# EasyEDA Pro project 多组分NO.2.eprj, schematic 多组分

## Sheets
1 主板: Board Name: Board1; Create Date: 2025-03-08; Page Name: 主板; Project Name: 多组分NO.2; Schematic Name: 多组分; Update Date: 2025-04-07; Company: 嘉立创EDA; Page Size: A4; Version: V1.0
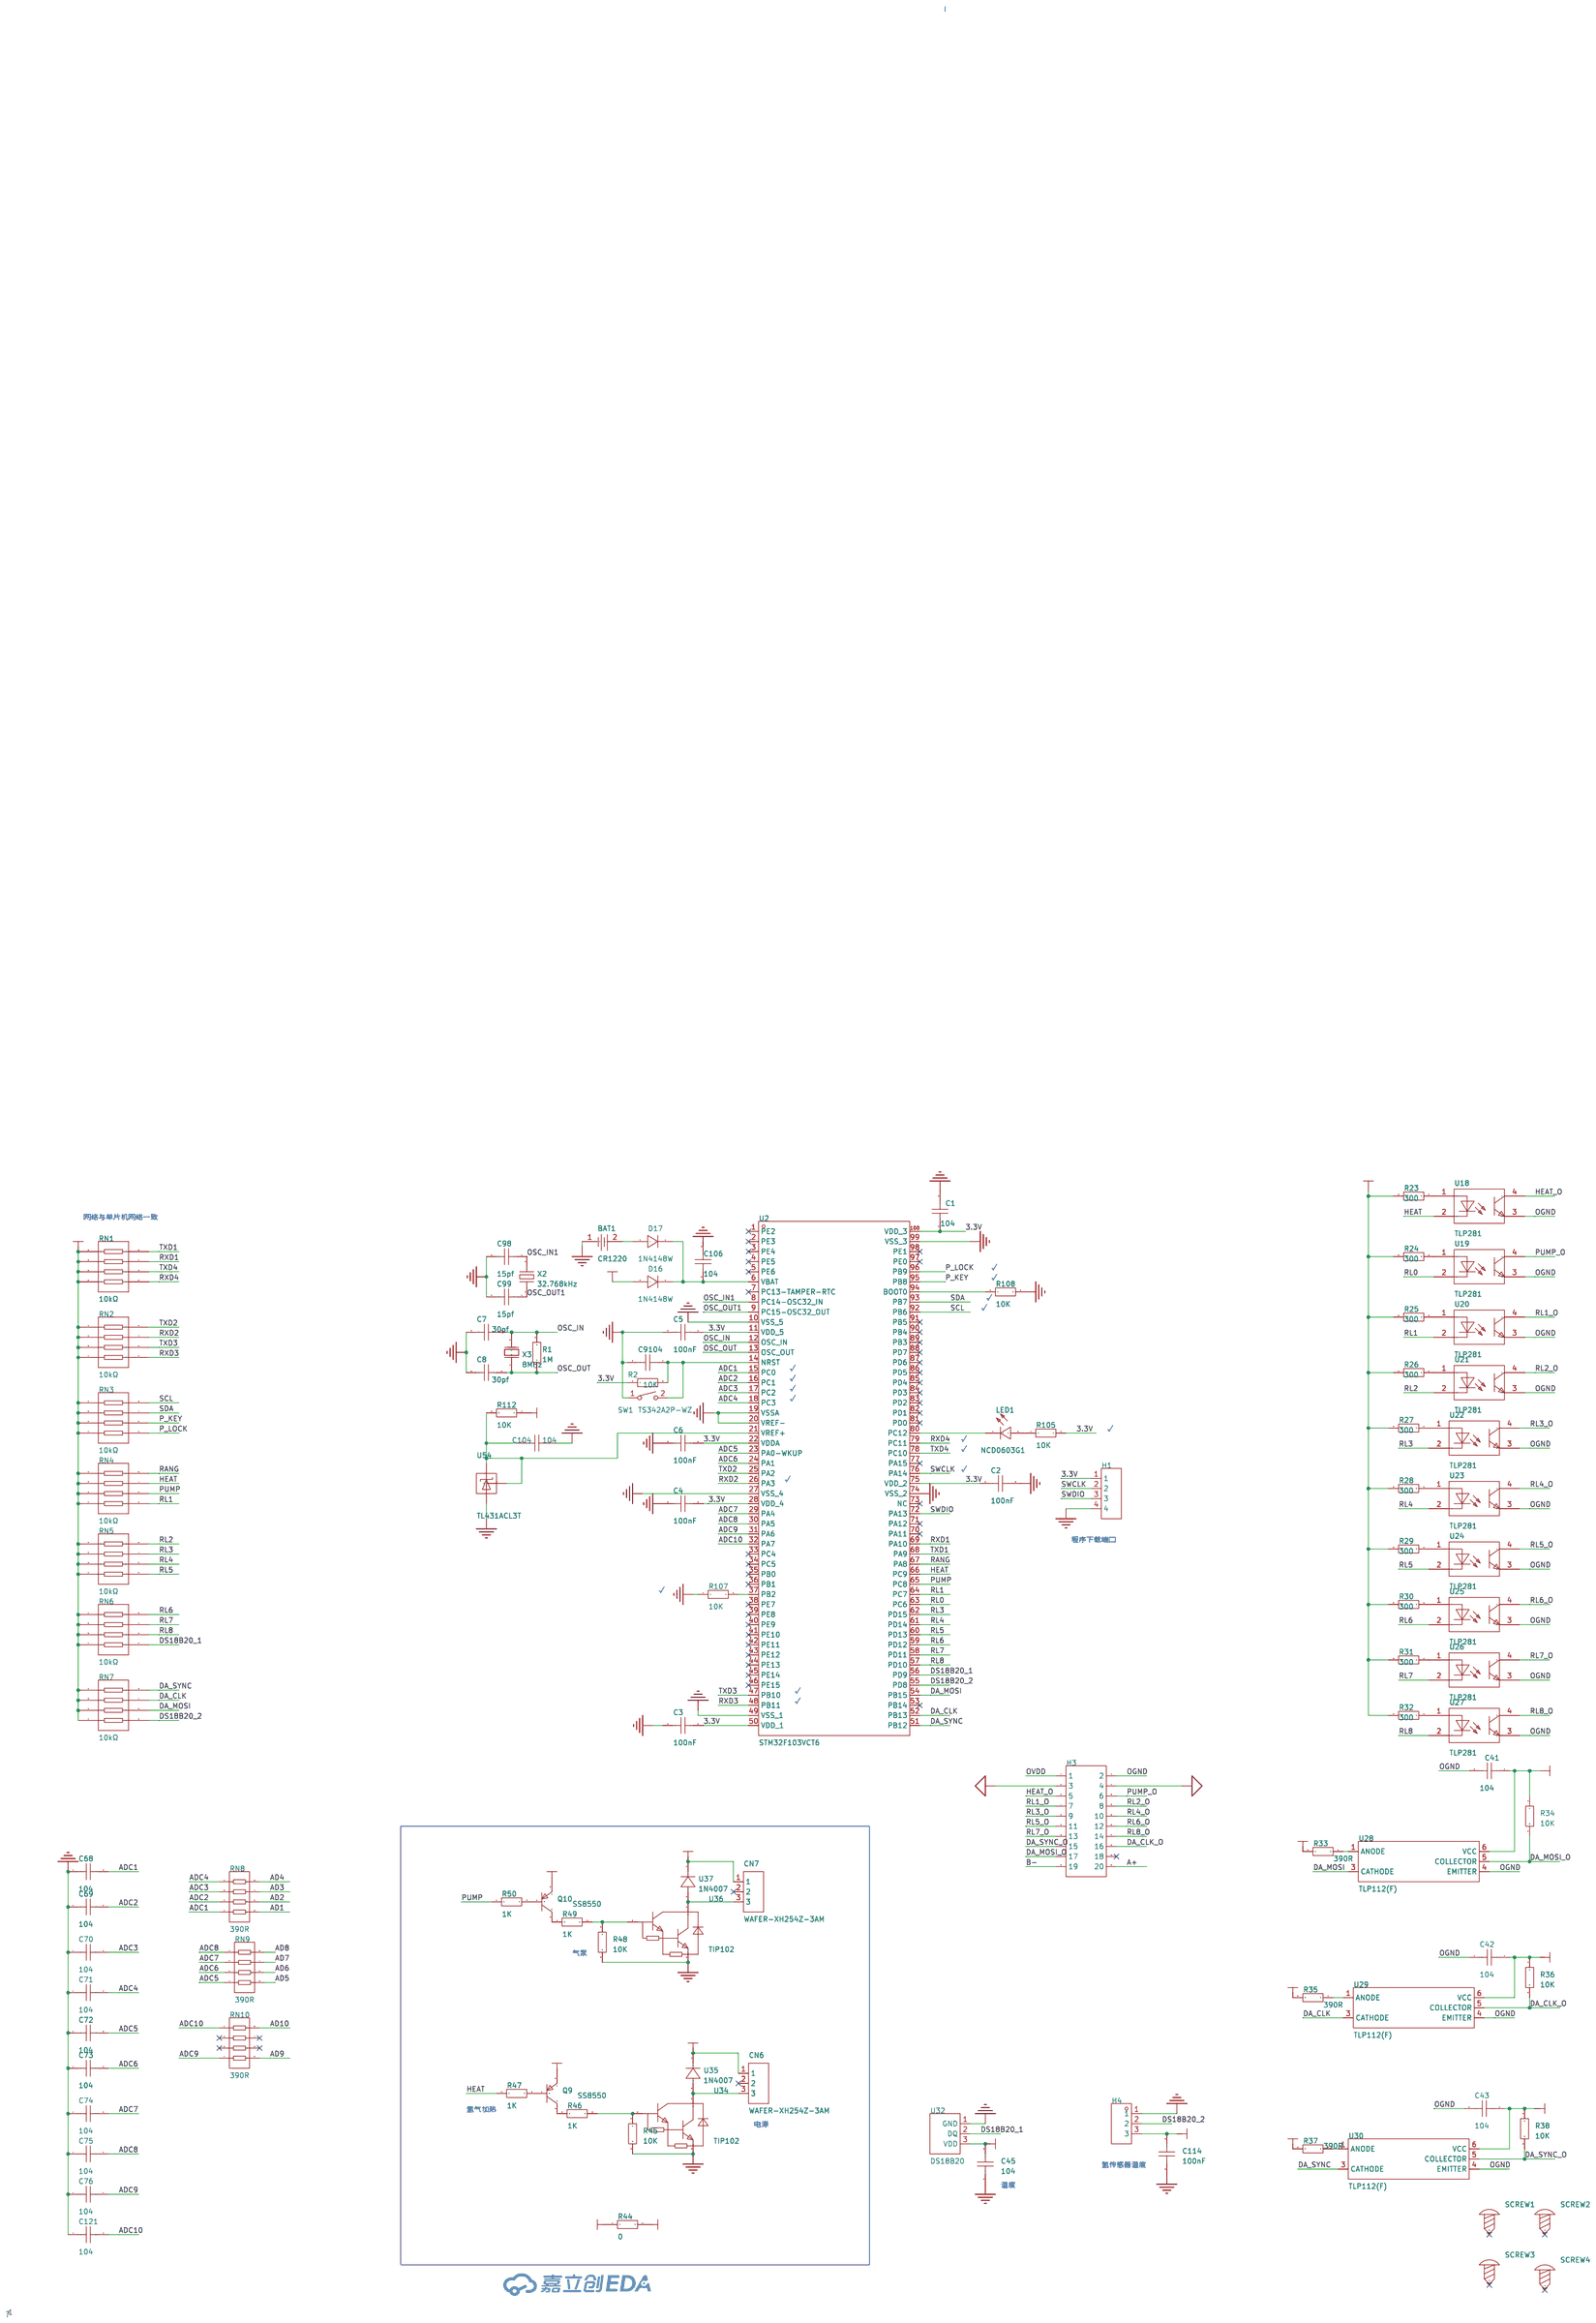
[diagram p0: 主板]
2 电源: Create Date: 2025-03-31; Page Name: 电源
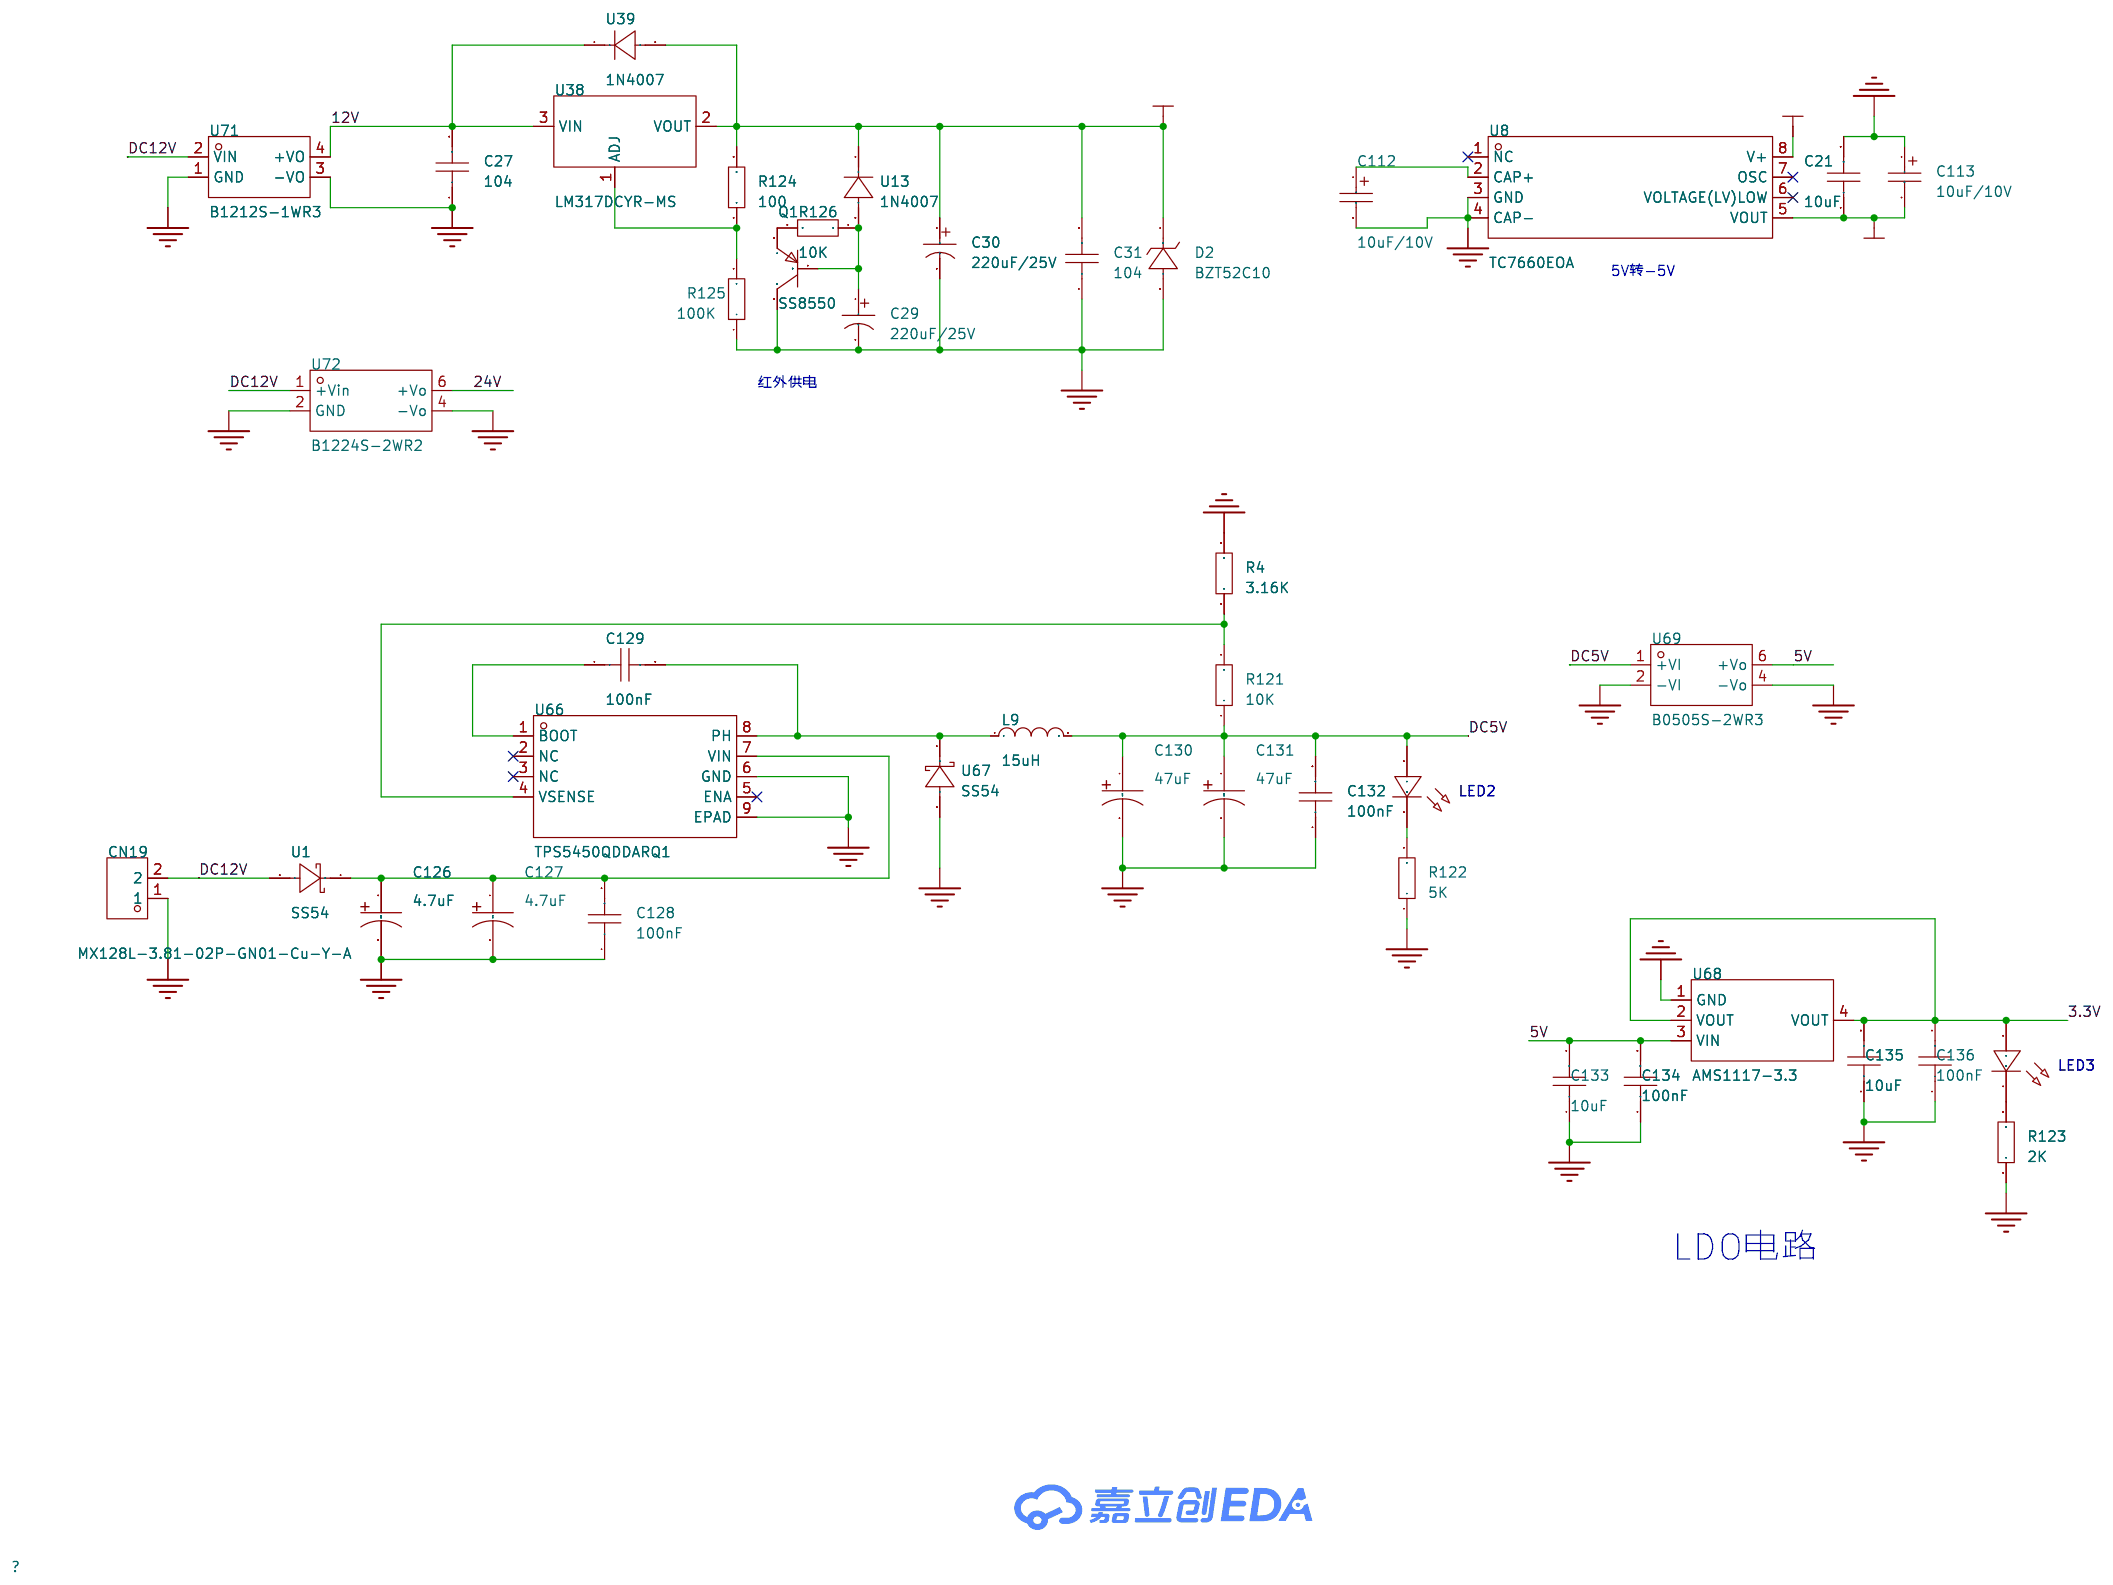
[diagram p1: 电源]
3 通讯: Create Date: 2025-03-31; Page Name: 通讯
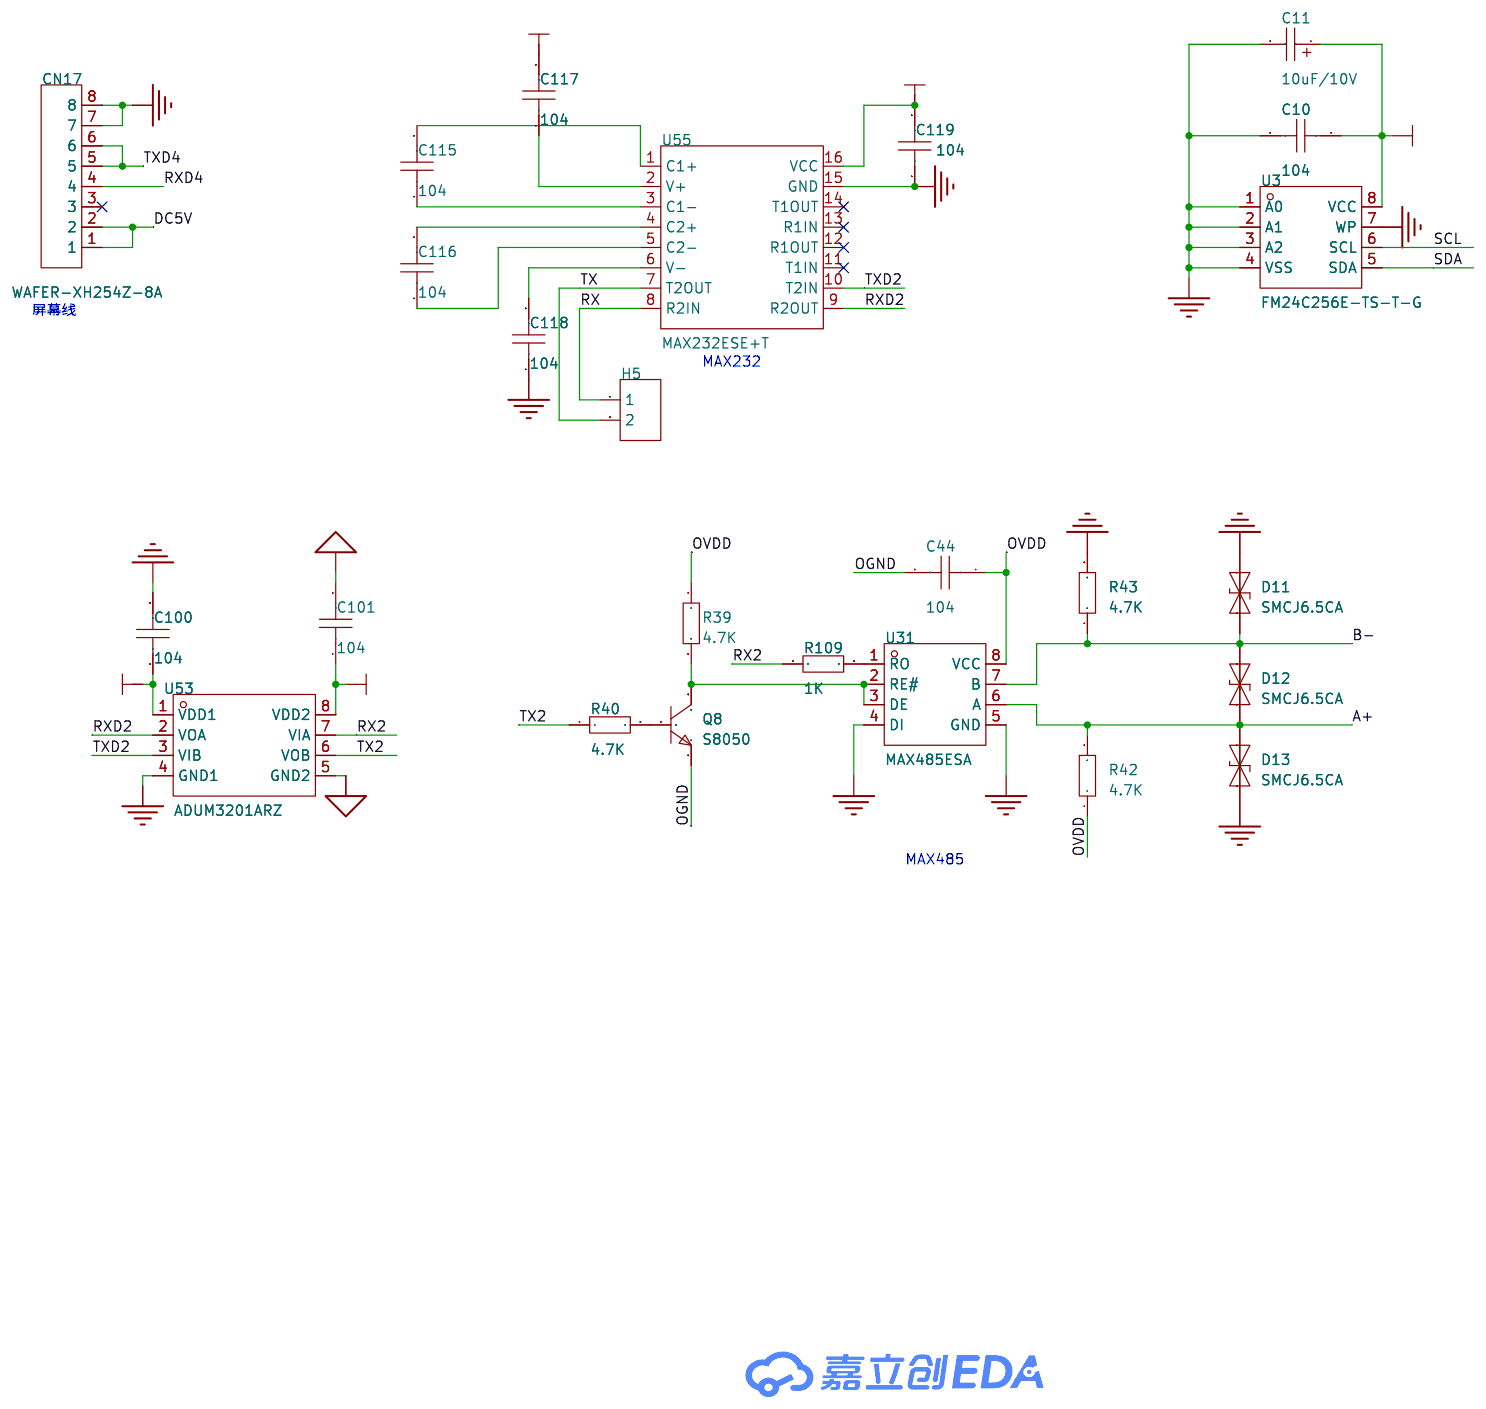
[diagram p2: 通讯]
4 采集: Create Date: 2025-04-03; Page Name: 采集
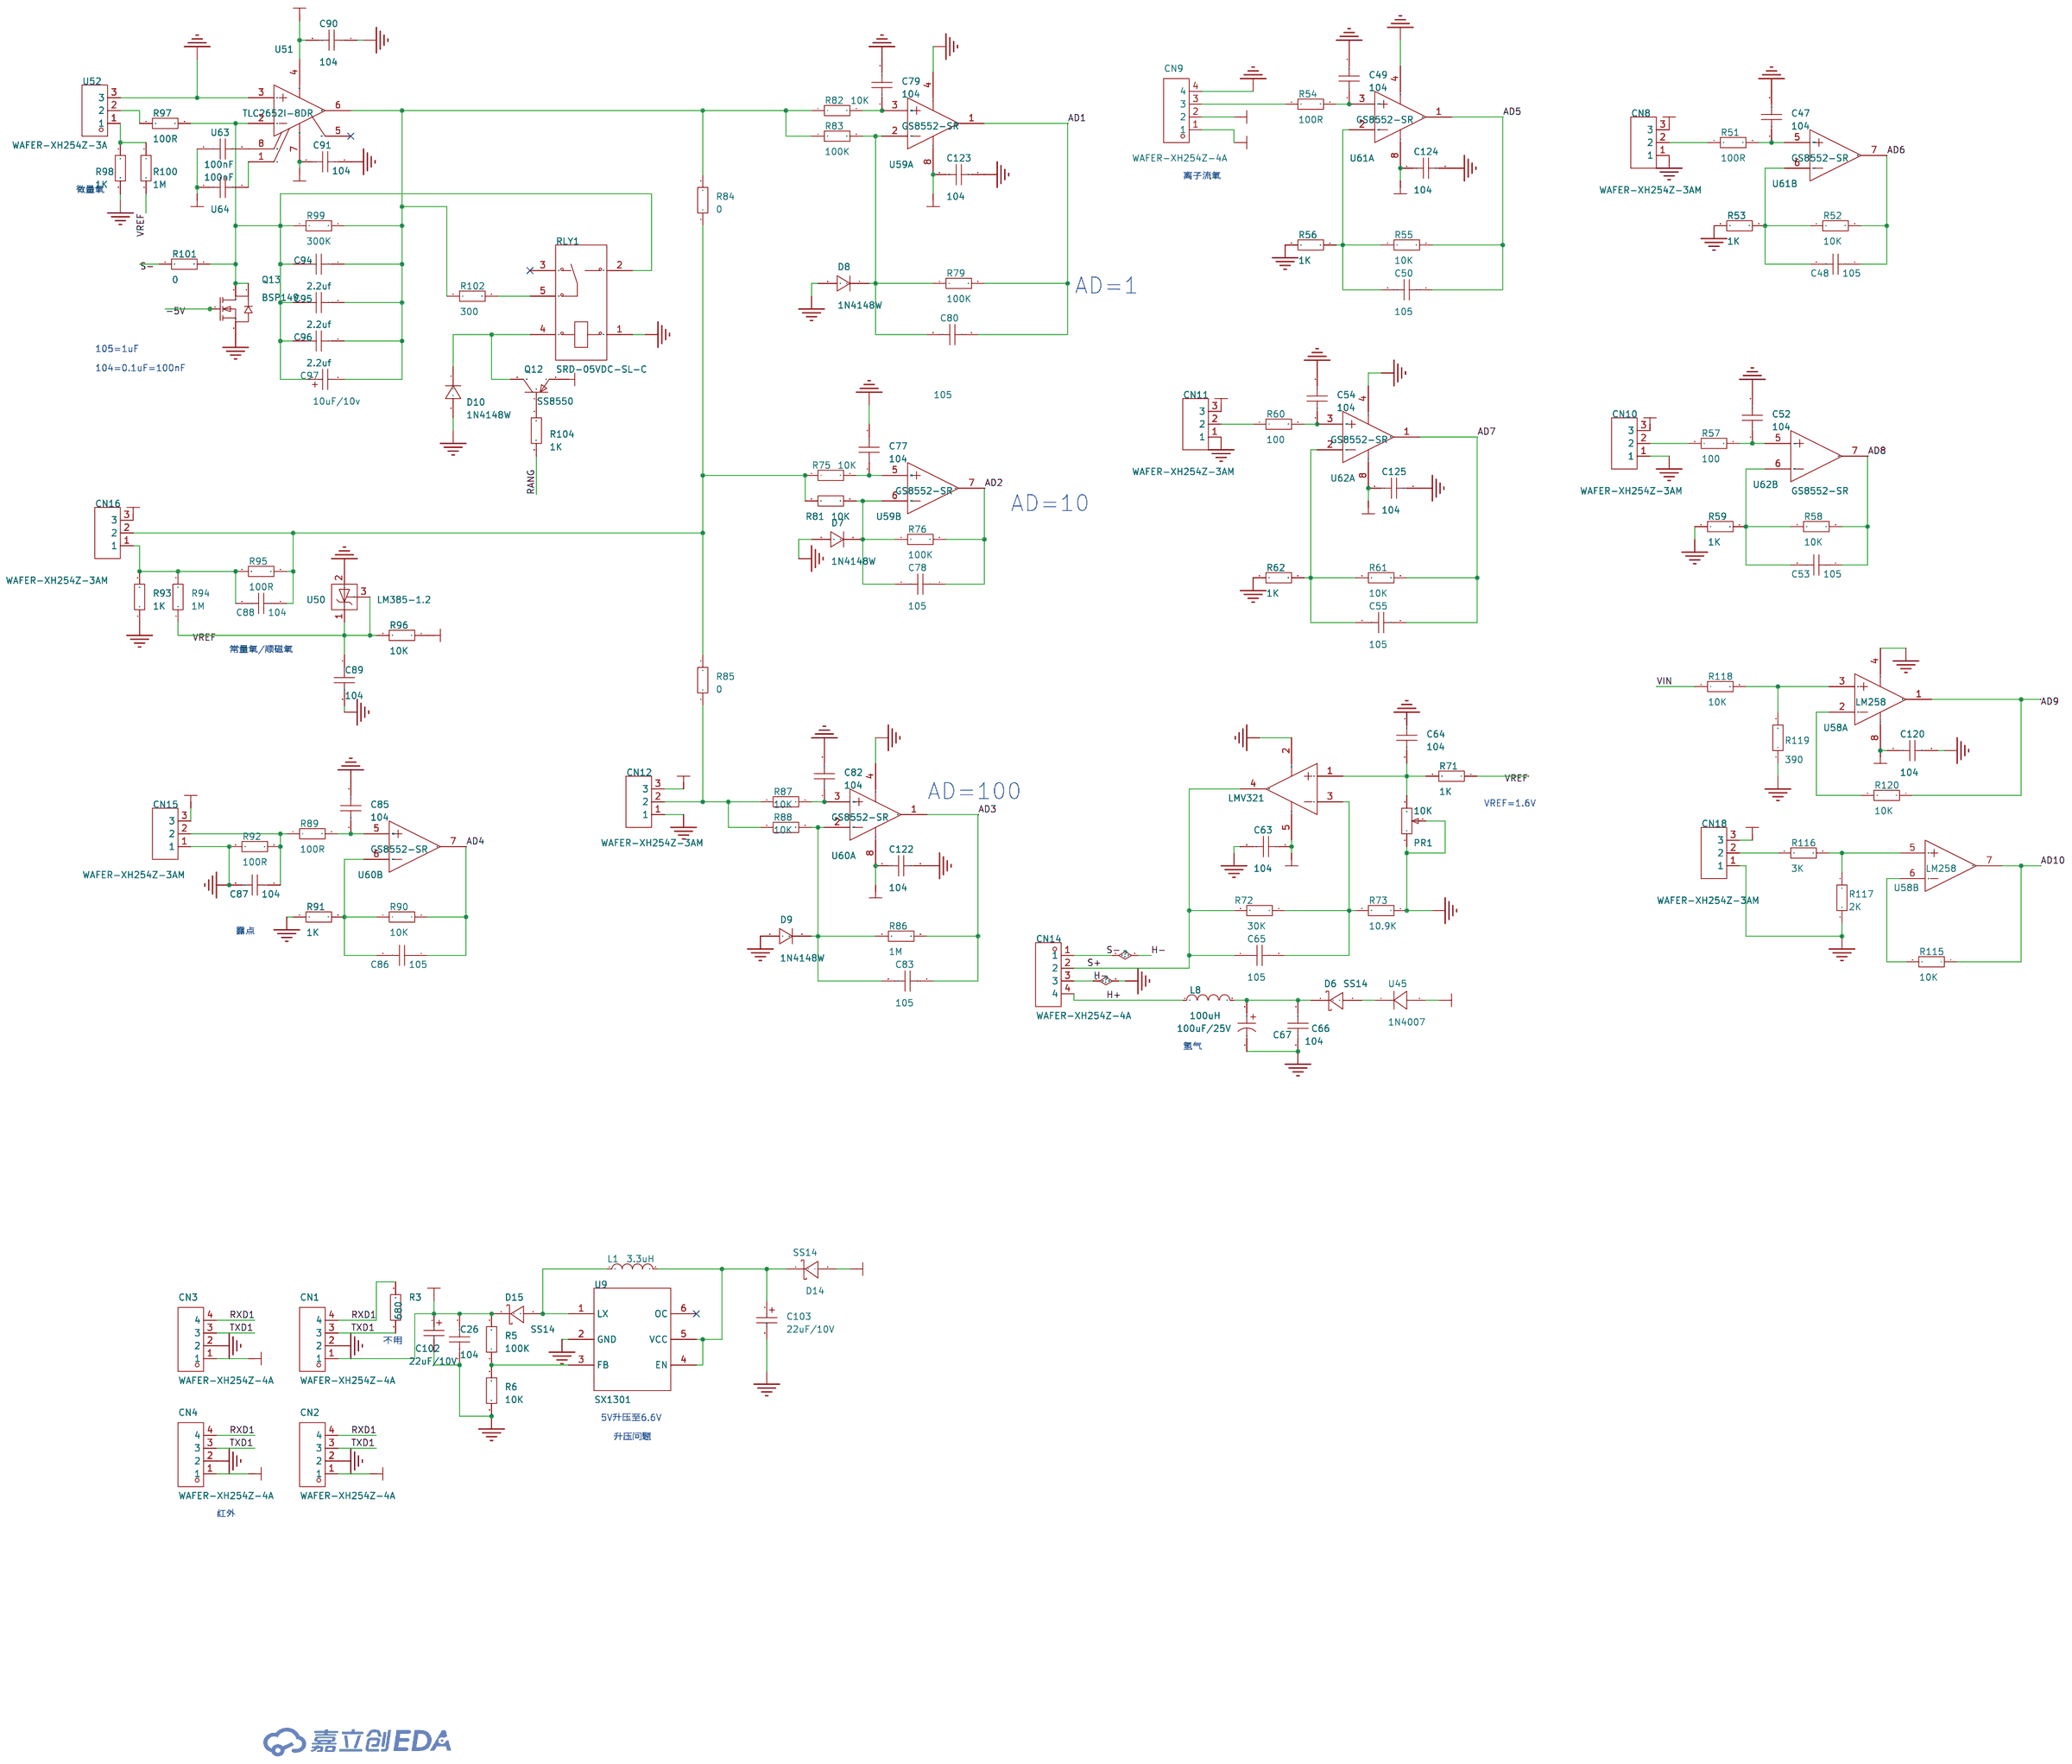
[diagram p3: 采集]

## Parts
sheet 主板
BAT1  CR1220  [TH_BD12.5-P12.0-RD-CR1220]
C1  104  [C0603]
C2  100nF  [C0603]
C3  100nF  [C0603]
C4  100nF  [C0603]
C5  100nF  [C0603]
C6  100nF  [C0603]
C7  30pf  [C0603]
C8  30pf  [C0603]
C9  104  [C0603]
C41  104  [C0603]
C42  104  [C0603]
C43  104  [C0603]
C45  104  [C0603]
C68  104  [C0603]
C69  104  [C0603]
C70  104  [C0603]
C71  104  [C0603]
C72  104  [C0603]
C73  104  [C0603]
C74  104  [C0603]
C75  104  [C0603]
C76  104  [C0603]
C98  15pf  [C0603]
C99  15pf  [C0603]
C104  104  [C0603]
C106  104  [C0603]
C114  100nF  [C0603]
C121  104  [C0603]
CN6  WAFER-XH254Z-3AM  [CONN-TH_3P-P2.50_JS25T-S03XHW-00]
CN7  WAFER-XH254Z-3AM  [CONN-TH_3P-P2.50_JS25T-S03XHW-00]
D16  1N4148W  [SOD-123F_L2.7-W1.6-LS3.8-RD]
D17  1N4148W  [SOD-123F_L2.7-W1.6-LS3.8-RD]
H1  -  [HDR-TH_4P-P2.54-V-M]
H3  -  [HDR-TH_20P-P2.54-V-R2-C10-S2.54]
H4  -  [HDR-TH_3P-P2.54-V-F]
LED1  NCD0603G1  [LED0603-RD_1]
Q9  SS8550  [SOT-23-3_L2.9-W1.3-P1.90-LS2.4-BR]
Q10  SS8550  [SOT-23-3_L2.9-W1.3-P1.90-LS2.4-BR]
R1  1M  [R0603]
R2  10K  [R0603]
R23  300  [R0603]
R24  300  [R0603]
R25  300  [R0603]
R26  300  [R0603]
R27  300  [R0603]
R28  300  [R0603]
R29  300  [R0603]
R30  300  [R0603]
R31  300  [R0603]
R32  300  [R0603]
R33  390R  [R0603]
R34  10K  [R0603]
R35  390R  [R0603]
R36  10K  [R0603]
R37  390R  [R0603]
R38  10K  [R0603]
R44  0  [R0603]
R45  10K  [R0603]
R46  1K  [R0603]
R47  1K  [R0603]
R48  10K  [R0603]
R49  1K  [R0603]
R50  1K  [R0603]
R105  10K  [R0603]
R107  10K  [R0603]
R108  10K  [R0603]
R112  10K  [R0603]
RN1  10kΩ  [RES-ARRAY-SMD_0603-8P-L3.2-W1.6-BL]
RN2  10kΩ  [RES-ARRAY-SMD_0603-8P-L3.2-W1.6-BL]
RN3  10kΩ  [RES-ARRAY-SMD_0603-8P-L3.2-W1.6-BL]
RN4  10kΩ  [RES-ARRAY-SMD_0603-8P-L3.2-W1.6-BL]
RN5  10kΩ  [RES-ARRAY-SMD_0603-8P-L3.2-W1.6-BL]
RN6  10kΩ  [RES-ARRAY-SMD_0603-8P-L3.2-W1.6-BL]
RN7  10kΩ  [RES-ARRAY-SMD_0603-8P-L3.2-W1.6-BL]
RN8  390R  [RES-ARRAY-SMD_0603-8P-L3.2-W1.6-BL]
RN9  390R  [RES-ARRAY-SMD_0603-8P-L3.2-W1.6-BL]
RN10  390R  [RES-ARRAY-SMD_0603-8P-L3.2-W1.6-BL]
SCREW1  -  [M3螺丝]
SCREW2  -  [M3螺丝]
SCREW3  -  [M3螺丝]
SCREW4  -  [M3螺丝]
SW1  TS342A2P-WZ  [SW-SMD_L4.0-W2.9-LS5.0]
U2  STM32F103VCT6  [LQFP-100_L14.0-W14.0-P0.50-LS16.0-BL]
U18  TLP281  [SOP-4_L4.4-W2.6-P1.27-LS7.0-TL]
U19  TLP281  [SOP-4_L4.4-W2.6-P1.27-LS7.0-TL]
U20  TLP281  [SOP-4_L4.4-W2.6-P1.27-LS7.0-TL]
U21  TLP281  [SOP-4_L4.4-W2.6-P1.27-LS7.0-TL]
U22  TLP281  [SOP-4_L4.4-W2.6-P1.27-LS7.0-TL]
U23  TLP281  [SOP-4_L4.4-W2.6-P1.27-LS7.0-TL]
U24  TLP281  [SOP-4_L4.4-W2.6-P1.27-LS7.0-TL]
U25  TLP281  [SOP-4_L4.4-W2.6-P1.27-LS7.0-TL]
U26  TLP281  [SOP-4_L4.4-W2.6-P1.27-LS7.0-TL]
U27  TLP281  [SOP-4_L4.4-W2.6-P1.27-LS7.0-TL]
U28  TLP112(F)  [SOIC-5_L4.4-W3.6-P1.27-LS7.0-BL]
U29  TLP112(F)  [SOIC-5_L4.4-W3.6-P1.27-LS7.0-BL]
U30  TLP112(F)  [SOIC-5_L4.4-W3.6-P1.27-LS7.0-BL]
U32  DS18B20  [TO-92-3_L4.6-W3.6-P1.27-L-1]
U34  TIP102  [TO-220-3_L10.0-W4.6-P2.54-L]
U35  1N4007  [SMA_L4.3-W2.6-LS5.1-RD]
U36  TIP102  [TO-220-3_L10.0-W4.6-P2.54-L]
U37  1N4007  [SMA_L4.3-W2.6-LS5.1-RD]
U54  TL431ACL3T  [SOT-23-3_L2.9-W1.3-P1.90-LS2.4-BR]
X2  32.768kHz  [OSC-SMD_L3.2-W1.5]
X3  8MHz  [CRYSTAL-SMD_2P-L5.0-W3.2]
sheet 电源
C21  10uF  [C0603]
C27  104  [C0603]
C29  220uF/25V  [CAP-TH_BD6.3-P2.50-D1.0-FD]
C30  220uF/25V  [CAP-TH_BD6.3-P2.50-D1.0-FD]
C31  104  [C0603]
C112  10uF/10V  [C_Ele_SMD_3x5.4mm]
C113  10uF/10V  [C_Ele_SMD_3x5.4mm]
C126  4.7uF  [CAP-SMD_BD4.0-L4.3-W4.3-FD]
C127  4.7uF  [CAP-SMD_BD4.0-L4.3-W4.3-FD]
C128  100nF  [C0603]
C129  100nF  [C0603]
C130  47uF  [CAP-SMD_BD4.0-L4.3-W4.3-FD]
C131  47uF  [CAP-SMD_BD4.0-L4.3-W4.3-FD]
C132  100nF  [C0603]
C133  10uF  [C0603]
C134  100nF  [C0603]
C135  10uF  [C0603]
C136  100nF  [C0603]
CN19  MX128L-3.81-02P-GN01-Cu-Y-A  [CONN-TH_2P-P3.81_MX128L-3.81-GN01-02P-CU-Y-A]
D2  BZT52C10  [SOD-123_L2.7-W1.6-LS3.7-RD-1]
L9  15uH  [IND-SMD_L7.3-W6.6]
LED2  -  [LED_0603]
LED3  -  [LED_0603]
Q1  SS8550  [SOT-23-3_L2.9-W1.3-P1.90-LS2.4-BR]
R4  3.16K  [R0603]
R121  10K  [R0603]
R122  5K  [R0603]
R123  2K  [R0603]
R124  100  [R0603]
R125  100K  [R0603]
R126  10K  [R0603]
U1  SS54  [SMA_L4.2-W2.6-LS5.1-RD]
U8  TC7660EOA  [SOIC-8_L4.9-W3.9-P1.27-LS6.0-BL]
U13  1N4007  [SMA_L4.3-W2.6-LS5.1-RD]
U38  LM317DCYR-MS  [SOT-223-3_L6.5-W3.4-P2.30-LS7.0-BR-1]
U39  1N4007  [SMA_L4.3-W2.6-LS5.1-RD]
U66  TPS5450QDDARQ1  [SOIC-8_L4.9-W3.9-P1.27-LS6.0-BL-EP]
U67  SS54  [SMA_L4.2-W2.6-LS5.1-RD]
U68  AMS1117-3.3  [SOT-223-3_L6.5-W3.4-P2.30-LS7.0-BR]
U69  B0505S-2WR3  [PWRM-TH_BXXXXS-2WR3]
U71  B1212S-1WR3  [PWRM-TH_4P-L11.5-W6.1-P2.54_TME1212S]
U72  B1224S-2WR2  [PWRM-TH_YLPTEC_BXXXXS-2WR2]
sheet 通讯
C10  104  [C0603]
C11  10uF/10V  [C_Ele_SMD_3x5.4mm]
C44  104  [C0603]
C100  104  [C0603]
C101  104  [C0603]
C115  104  [C0603]
C116  104  [C0603]
C117  104  [C0603]
C118  104  [C0603]
C119  104  [C0603]
CN17  WAFER-XH254Z-8A  [CONN-TH_WAFER-XH254Z-8A]
D11  SMCJ6.5CA  [SMC_L6.9-W5.9-LS7.9-BI]
D12  SMCJ6.5CA  [SMC_L6.9-W5.9-LS7.9-BI]
D13  SMCJ6.5CA  [SMC_L6.9-W5.9-LS7.9-BI]
H5  -  [HDR-TH_2P-P2.54-V-F]
Q8  S8050  [SOT-23-3_L3.0-W1.7-P0.95-LS2.9-BR]
R39  4.7K  [R0603]
R40  4.7K  [R0603]
R42  4.7K  [R0603]
R43  4.7K  [R0603]
R109  1K  [R0603]
U3  FM24C256E-TS-T-G  [TSSOP-8_L4.4-W3.0-P0.65-LS6.4-BL]
U31  MAX485ESA  [SOP-8_L4.9-W3.9-P1.27-LS6.0-BL]
U53  ADUM3201ARZ  [SOIC-8_L4.9-W3.9-P1.27-LS6.0-BL]
U55  MAX232ESE+T  [SOIC-16_L9.9-W3.9-P1.27-LS6.0-BL]
sheet 采集
C26  104  [C0603]
C47  104  [C0603]
C48  105  [C0603]
C49  104  [C0603]
C50  105  [C0603]
C52  104  [C0603]
C53  105  [C0603]
C54  104  [C0603]
C55  105  [C0603]
C63  104  [C0603]
C64  104  [C0603]
C65  105  [C0603]
C66  104  [C0603]
C67  100uF/25V  [CAP-TH_BD6.3-P2.50-D0.6-FD]
C77  104  [C0603]
C78  105  [C0603]
C79  104  [C0603]
C80  105  [C0603]
C82  104  [C0603]
C83  105  [C0603]
C85  104  [C0603]
C86  105  [C0603]
C87  104  [C0603]
C88  104  [C0603]
C89  104  [C0603]
C90  104  [C0603]
C91  104  [C0603]
C94  2.2uf  [C0603]
C95  2.2uf  [C0603]
C96  2.2uf  [C0603]
C97  10uF/10v  [CASE-A_3216]
C102  22uF/10V  [C_Ele_SMD_3x5.4mm]
C103  22uF/10V  [C_Ele_SMD_3x5.4mm]
C120  104  [C0603]
C122  104  [C0603]
C123  104  [C0603]
C124  104  [C0603]
C125  104  [C0603]
CN1  WAFER-XH254Z-4A  [CONN-TH_XH-4A]
CN2  WAFER-XH254Z-4A  [CONN-TH_XH-4A]
CN3  WAFER-XH254Z-4A  [CONN-TH_XH-4A]
CN4  WAFER-XH254Z-4A  [CONN-TH_XH-4A]
CN8  WAFER-XH254Z-3AM  [CONN-TH_3P-P2.50_JS25T-S03XHW-00]
CN9  WAFER-XH254Z-4A  [CONN-TH_XH-4A]
CN10  WAFER-XH254Z-3AM  [CONN-TH_3P-P2.50_JS25T-S03XHW-00]
CN11  WAFER-XH254Z-3AM  [CONN-TH_3P-P2.50_JS25T-S03XHW-00]
CN12  WAFER-XH254Z-3AM  [CONN-TH_3P-P2.50_JS25T-S03XHW-00]
CN14  WAFER-XH254Z-4A  [CONN-TH_XH-4A]
CN15  WAFER-XH254Z-3AM  [CONN-TH_3P-P2.50_JS25T-S03XHW-00]
CN16  WAFER-XH254Z-3AM  [CONN-TH_3P-P2.50_JS25T-S03XHW-00]
CN18  WAFER-XH254Z-3AM  [CONN-TH_3P-P2.50_JS25T-S03XHW-00]
D6  SS14  [SMA_L4.2-W2.6-LS5.3-RD]
D7  1N4148W  [SOD-123F_L2.7-W1.6-LS3.8-RD]
D8  1N4148W  [SOD-123F_L2.7-W1.6-LS3.8-RD]
D9  1N4148W  [SOD-123F_L2.7-W1.6-LS3.8-RD]
D10  1N4148W  [SOD-123F_L2.7-W1.6-LS3.8-RD]
D14  SS14  [SMA_L4.2-W2.6-LS5.3-RD]
D15  SS14  [SMA_L4.2-W2.6-LS5.3-RD]
L1  3.3uH  [IND-SMD_L4.5-W4.1_SL0420]
L8  100uH  [IND-SMD_L5.0-W5.0-VLCF5028T]
PR1  10K  [R_3386P]
Q12  SS8550  [SOT-23-3_L2.9-W1.3-P1.90-LS2.4-BR]
Q13  BSP149  [SOT-223-4_L6.5-W3.5-P2.30-LS7.0-BR]
R3  680  [R0603]
R5  100K  [R0603]
R6  10K  [R0603]
R51  100R  [R0603]
R52  10K  [R0603]
R53  1K  [R0603]
R54  100R  [R0603]
R55  10K  [R0603]
R56  1K  [R0603]
R57  100  [R0603]
R58  10K  [R0603]
R59  1K  [R0603]
R60  100  [R0603]
R61  10K  [R0603]
R62  1K  [R0603]
R71  1K  [R0603]
R72  30K  [R0603]
R73  10.9K  [R0603]
R75  10K  [R0603]
R76  100K  [R0603]
R79  100K  [R0603]
R81  10K  [R0603]
R82  10K  [R0603]
R83  100K  [R0603]
R84  0  [R0603]
R85  0  [R0603]
R86  1M  [R0603]
R87  10K  [R0603]
R88  10K  [R0603]
R89  100R  [R0603]
R90  10K  [R0603]
R91  1K  [R0603]
R92  100R  [R0603]
R93  1K  [R0603]
R94  1M  [R0603]
R95  100R  [R0603]
R96  10K  [R0603]
R97  100R  [R0603]
R98  1K  [R0603]
R99  300K  [R0603]
R100  1M  [R0603]
R101  0  [R0603]
R102  300  [R0603]
R104  1K  [R0603]
R115  10K  [R0603]
R116  3K  [R0603]
R117  2K  [R0603]
R118  10K  [R0603]
R119  390  [R0603]
R120  10K  [R0603]
RLY1  SRD-05VDC-SL-C  [RELAY-TH_SRD-XXVDC-XL-C]
U9  SX1301  [SOT-23-6_L2.9-W1.6-P0.95-LS2.8-BR]
U44  LMV321  [SOT-23-5_L3.0-W1.7-P0.95-LS2.8-BR]
U45  1N4007  [SMA_L4.3-W2.6-LS5.1-RD]
U50  LM385-1.2  [SOT-23-3_L2.9-W1.4-P1.90-LS2.5-BR]
U51  TLC2652I-8DR  [SOIC-8_L4.9-W3.9-P1.27-LS6.0-BL]
U52  WAFER-XH254Z-3A  [CONN-TH_XH-3A]
U58  LM258  [SOIC-8_L4.9-W3.9-P1.27-LS6.0-BL]  (sections 1,2)
U59  GS8552-SR  [SOIC-8_L4.9-W3.9-P1.27-LS6.0-BL]  (sections 1,2)
U60  GS8552-SR  [SOIC-8_L4.9-W3.9-P1.27-LS6.0-BL]  (sections 1,2)
U61  GS8552-SR  [SOIC-8_L4.9-W3.9-P1.27-LS6.0-BL]  (sections 1,2)
U62  GS8552-SR  [SOIC-8_L4.9-W3.9-P1.27-LS6.0-BL]  (sections 1,2)
U63  100nF  [CAP-SMD_L4.8-W3.3_1]
U64  100nF  [CAP-SMD_L4.8-W3.3_1]

## Library data of the parts
BAT1 = CR1220: LCSC Part Name: LX(连欣科技) 锂锰电池 3V 40mAh 1个; Supplier Part: C21882464; Manufacturer: LX(连欣科技); Supplier Footprint: 插件,D=12.5mm; Datasheet: https://atta.szlcsc.com/upload/public/pdf/source/20240311/A384A705F0D788A818A5AA4F15F1B887.pdf; Supplier: LCSC; voltage: 3V; capacity: 40mAh; chemical composition: 锂锰; appearance: 纽扣; size: 12mm×2mm; battery type: 电池; Battery chargeability: 不可充电
C1-C10 C26 C27 C31 C41-C45 C47-C50 C52-C55 C63-C66 C68-C80 C82 C83 C85-C91 C94-C96 C98-C101 C104 C106 C114-C125 C128 C129 C132-C136 = CAP_0603: Supplier Footprint: 0603
CN6-CN8 CN10-CN12 CN15 CN16 CN18 = WAFER-XH254Z-3AM: LCSC Part Name: XH直针3P 耐高温米色; Supplier Part: C22751823; Manufacturer: HANBO(汉博); Supplier Footprint: 插件,P=2.54mm; JLCPCB Part Class: 扩展库; Datasheet: https://atta.szlcsc.com/upload/public/pdf/source/20240628/5F265ED5DCD1AB9F6070F992FAF53820.pdf; Supplier: LCSC
D7-D10 D16 D17 = 1N4148W_C81598: Supplier Part: C81598; Manufacturer: ST(先科); Supplier Footprint: SOD-123; JLCPCB Part Class: 基础库; Datasheet: https://atta.szlcsc.com/upload/public/pdf/source/20161024/1477288446905.pdf; Supplier: LCSC; Diode Configuration: 独立式; Forward Voltage (Vf@If): 1V@50mA; Reverse Voltage (Vr): 75V; Rectified Current: 150mA; Reverse Leakage Current (Ir): 1uA@75V; Reverse Recovery Time (trr): 4ns
H1 = HDR-M_2.54_1x4P: Supplier Part: C492403; Supplier Footprint: 插件
H3 = HDR-F_2.54_2x10: Supplier Part: C30867; Supplier Footprint: 插件
H4 = HDR-F_2.54_1x3P: Supplier Part: C541850; Supplier Footprint: 插件
LED1 = NCD0603G1: Supplier Part: C84267; Manufacturer: 国星光电; Supplier Footprint: 0603; Datasheet: https://atta.szlcsc.com/upload/public/pdf/source/20200820/C84267_04BA7703640BAC111D09F5EFB971FBF3.pdf; Supplier: LCSC; Illumination Color: 翠绿色; Voltage - Forward(Vf): 2.6V~3.6V; Power(Watts): 72mW; Forward Current: 20mA; Wavelength - Dominant: 515nm~530nm; Luminous Intensity: 330mcd~900mcd; Viewing Angle: 130°; Operating Temperature: -30℃~+85℃
Q1 Q9 Q10 Q12 = SS8550 Y2(RANGE:200-350): LCSC Part Name: PNP 电流:1.5A 耐压:25V hfe=200~350; Supplier Part: C8542; Manufacturer: CJ(江苏长电/长晶); Supplier Footprint: SOT-23; JLCPCB Part Class: 基础库; Datasheet: https://atta.szlcsc.com/upload/public/pdf/source/20140809/1457707214734.pdf; Supplier: LCSC; Transistor Type: PNP; Collector Current (Ic): 1.5A; Collector-Emitter Breakdown Voltage (Vceo): 25V; Power Dissipation (Pd): 300mW; DC Current Gain (hFE@Ic,Vce): 200@100mA,1V; Transition Frequency (fT): 100MHz; Collector Cut-Off Current (Icbo): 100nA; Collector-Emitter Saturation Voltage (VCE(sat)@Ic,Ib): 500mV@800mA,80mA; Operating Temperature: -55℃~+150℃
R1-R6 R23-R40 R42-R62 R71-R73 R75 R76 R79 R81-R102 R104 R105 R107-R109 R112 R115-R126 = Res_0603: Supplier Footprint: 0603
RN1-RN7 = 4D03WGJ0103T5E: LCSC Part Name: 10kΩ ±5%; Supplier Part: C29718; Manufacturer: UNI-ROYAL(厚声); Supplier Footprint: 0603x4; JLCPCB Part Class: 基础库; Datasheet: https://atta.szlcsc.com/upload/public/pdf/source/20191224/C474318_2527498AE30E813171187CCD28401A71.pdf; Supplier: LCSC; Number of Resistors: 4; Tolerance: ±5%; Power(Watts): 62.5mW; Temperature Coefficient: ±200ppm/℃; Number of Pins: 8
RN8-RN10 = 4D03WGF3900T5E: LCSC Part Name: 390Ω ±1%; Supplier Part: C2977985; Manufacturer: UNI-ROYAL(厚声); Supplier Footprint: 0603x4; JLCPCB Part Class: 扩展库; Datasheet: https://atta.szlcsc.com/upload/public/pdf/source/20191224/C474318_2527498AE30E813171187CCD28401A71.pdf; Supplier: LCSC; Number of Resistors: 4; Tolerance: ±1%; Power(Watts): 62.5mW; Temperature Coefficient: ±200ppm/℃; Number of Pins: 8
SCREW1-SCREW4 = M3螺丝: Supplier Footprint: 插件
SW1 = TS342A2P-WZ: LCSC Part Name: 3.95*2.9*2mm 立贴 轻触开关; Supplier Part: C557591; Manufacturer: SHOU HAN(首韩); Supplier Footprint: SMD; Datasheet: https://atta.szlcsc.com/upload/public/pdf/source/20200519/C557591_B3A5A21584733303F06306F18577DA8B.pdf; Supplier: LCSC; Circuit: 单刀单掷; Actuator Style: 圆形按钮; Mounting Style: 立贴; Switch Length: 3.95mm; Switch Width: 2.9mm; Switch Height: 2mm; Strike Gundam: 不带; Contact Current: 50mA; Voltage Rating (DC): 12V; Insulation Resistance: 100MΩ; Actuator/Cap Color: 黑色; Pin Style: SMD接片; Mechanical Life: 3万次; Operating Temperature: -25℃~+70℃
U2 = STM32F103VCT6: LCSC Part Name: 主流增强型ARM Cortex-M3 MCU，具有256 KB Flash、72 MHz CPU、电机控制、USB和CAN; Supplier Part: C8313; Manufacturer: ST(意法半导体); Supplier Footprint: LQFP-100(14x14); JLCPCB Part Class: 扩展库; Datasheet: https://atta.szlcsc.com/upload/public/pdf/source/20191104/C443969_BBB78F97FCB1C210242AC41DD2A995A0.pdf; Supplier: LCSC; CPU Core: ARM-M3; CPU Maximum Speed: 72MHz; Program Storage Size: 256KB; Program Memory Type: FLASH; Number of I/O: 80; ADC (Bit): 12bit; DAC (Bit): 12bit; Low Voltage Detection Threshold: 2V~3.6V
U18-U27 = TLP281: Supplier Part: C9900004783; Supplier Footprint: SOP-4-2.6mm; JLCPCB Part Class: 扩展库; Supplier: LCSC
U28-U30 = TLP112(F): Supplier Part: C5331587; Manufacturer: TOSHIBA(东芝); Supplier Footprint: SOP-5; JLCPCB Part Class: 扩展库; Datasheet: https://atta.szlcsc.com/upload/public/pdf/source/20221215/FA221715623C1DFDFF8354E0697E69BF.pdf; Supplier: LCSC
U32 = DS18B20: LCSC Part Name: 数字温度传感芯片; Supplier Part: C20611523; Manufacturer: Mysentech(敏源传感); Supplier Footprint: TO-92; JLCPCB Part Class: 扩展库; Datasheet: https://atta.szlcsc.com/upload/public/pdf/source/20240923/8CFFA5DC8B967A6FD95E1DB1474E088C.pdf; Supplier: LCSC; Temperature Range: -55℃~+125℃; Tolerance: ±0.5℃; Voltage - Supply: 1.8V~5.5V; Standby Current: 200nA; Interface: 单总线
U34 U36 = TIP102_C22389992: LCSC Part Name: NPN 5A 100V 65W; Supplier Part: C22389992; Manufacturer: minos(迈诺斯); Supplier Footprint: TO-220; JLCPCB Part Class: 扩展库; Datasheet: https://atta.szlcsc.com/upload/public/pdf/source/20240425/08F81A9B66BE7D8A30723F640EBF26E5.pdf; Supplier: LCSC
U13 U35 U37 U39 U45 = 1N4007: Supplier Part: C9900004759; JLCPCB Part Class: 扩展库; Supplier: LCSC
U54 = TL431ACL3T: Supplier Part: C1852783; Manufacturer: ST(意法半导体); Supplier Footprint: SOT-23; Datasheet: https://atta.szlcsc.com/upload/public/pdf/source/20210420/C2802048_37F78FC0F812C8DF98C1B0E264FB5C1A.pdf; Supplier: LCSC; Output Type: 可调; Output Voltage: 2.495V~36V; Output Current: 100mA; Tolerance: ±1%; Reference Type: 并联; Operating Temperature: 0℃~+70℃@(Ta)
X2 = X321532768KGD2SI: LCSC Part Name: 32.768kHz ±20ppm 12.5pF; Supplier Part: C620155; Manufacturer: YXC(扬兴晶振); Supplier Footprint: SMD3215-2P; Datasheet: https://atta.szlcsc.com/upload/public/pdf/source/20240329/3A7650FD985DD0DE85694D3785AB4916.pdf; Supplier: LCSC; Crystal Type: 贴片晶振; Normal temperature Frequency Tolerance: ±20ppm; External load capacitor: 12.5pF; Operating Temperature: -40℃~+85℃
X3 = AA08000016: LCSC Part Name: 8MHz ±30ppm 18pF -40~+85 车规; Supplier Part: C409346; Manufacturer: TXC(晶技); Supplier Footprint: SMD5032; JLCPCB Part Class: 扩展库; Datasheet: https://atta.szlcsc.com/upload/public/pdf/source/20240312/C068D9016970EB4A26579D46BC4C5B5C.pdf; Supplier: LCSC; Type: 贴片晶振; Normal temperature Frequency Tolerance: ±30ppm; Load Capacitance: 18pF; Equivalent Series Resistance(ESR): 150Ω; Operating Temperature: -40℃~+85℃
C21 = CGA0603X5R106K100JT: LCSC Part Name: 10uF ±10% 10V; Supplier Part: C6119842; Manufacturer: HRE(芯声); Supplier Footprint: 0603; JLCPCB Part Class: 扩展库; Supplier: LCSC; Tolerance: ±10%; Voltage Rated: 10V; Temperature Coefficient: X5R
C29 C30 = ERS1EM221E11OT: LCSC Part Name: 220uF ±20% 25V; Supplier Part: C141282; Manufacturer: AISHI(艾华集团); Supplier Footprint: 插件,D6.3xL11mm; JLCPCB Part Class: 扩展库; Datasheet: https://atta.szlcsc.com/upload/public/pdf/source/20171106/C141282_15099694444351094052.pdf; Supplier: LCSC; Tolerance: ±20%; Rated Voltage: 25V; Lead Spacing: 2.5mm; φD: 6.3mm; L: 11mm; Lifetime @ Temp: 5000hrs@105℃
C11 C102 C103 C112 C113 = C_Ele_SMD_3x5.4mm: Supplier Footprint: SMD,3x5.4mm
C126 C127 C130 C131 = EEEHA1V4R7AR: 容值:4.7uF;精度:±20%;额定电压:35V;纹波电流:22mA@120Hz;等效串联电阻:-;; LCSC Part Name: 4.7uF ±20% 35V; Supplier Part: C401781; Manufacturer: PANASONIC(松下); Supplier Footprint: SMD,D4xL5.4mm; JLCPCB Part Class: 扩展库; Datasheet: https://atta.szlcsc.com/upload/public/pdf/source/20190702/C401781_47E4DF3A02756419760A56118B5BB24E.pdf; Supplier: LCSC; Tolerance: ±20%; Rated Voltage: 35V; Ripple Current: 22mA@120Hz; φD: 4mm; L: 5.4mm; Lifetime @ Temp: 1000hrs@105℃; Operating Temperature: -40℃~+105℃
CN19 = MX128L-3.81-02P-GN01-Cu-Y-A: 结构:1x2P;间距:3.81mm;颜色:绿色;安装方式:直插;排数:1;每排PIN数:2;额定电流:10A;额定电压:150V;线规 - AWG:16~26;线规 - 平方毫米:1.5;工作温度范围:-40℃~+105℃;; LCSC Part Name: 1x2P 3.81mm 直插 排数:1 每排P数:2; Supplier Part: C5188452; Manufacturer: MAX(迈旭); Supplier Footprint: 插件,P=3.81mm; JLCPCB Part Class: 扩展库; Datasheet: https://atta.szlcsc.com/upload/public/pdf/source/20230914/B6D11694B2EF123065C24316748628EB.pdf; Supplier: LCSC; Structure: 1x2P; Pitch: 3.81mm; Color: 绿色; Mounting Style: 直插; Number of Pins: 2P; Number of Rows: 1; Number of PINs Per Row: 2; Screw Specification: M2; Current Rating (Max): 10A; Voltage Rating (Max): 150V; Wire Gauge - AWG: 16~26; Wire Gauge - mm2: 1.5; Operating Temperature Range: -40℃~+105℃
D2 = BZT52C10: Supplier Part: C707140; Manufacturer: Slkor(萨科微); Supplier Footprint: SOD-123; JLCPCB Part Class: 扩展库; Datasheet: https://atta.szlcsc.com/upload/public/pdf/source/20200721/C707125_BAEA70ACC1B0F60BBAC1FD71D8806D24.pdf; Supplier: LCSC; Diode Configuration: 独立式; Zener Voltage (Nom): 10V; Reverse Leakage Current (Ir): 200nA@7V; Zener Voltage (Range): 9.4V~10.6V; Power Dissipation: 500mW; Zener Impedance (Zzt): 20Ω
L9 = 10uH/5A7*7mm一体成型电感: Supplier Part: C9900022584; JLCPCB Part Class: 扩展库; Supplier: LCSC
LED2 LED3 = LED_0603-G: Supplier Footprint: 0603
U1 U67 = SS54: Supplier Part: C9900023219; Supplier Footprint: (1N5824)DO-214; JLCPCB Part Class: 扩展库; Supplier: LCSC
U8 = TC7660EOA: Supplier Part: C636969; Manufacturer: MICROCHIP(美国微芯); Supplier Footprint: SOIC-8; JLCPCB Part Class: 扩展库; Datasheet: https://atta.szlcsc.com/upload/public/pdf/source/20140724/1457707166500.pdf; Supplier: LCSC
U38 = LM317DCYR-MS: Supplier Part: C7473164; Manufacturer: MSKSEMI(美森科); Supplier Footprint: SOT-223; JLCPCB Part Class: 扩展库; Datasheet: https://atta.szlcsc.com/upload/public/pdf/source/20231130/1AD4ED482F53116ADA3427DAD2350B06.pdf; Supplier: LCSC; Output Type: 固定; Maximum Input Voltage: 40V; Output Voltage: 1.2V~37V; Output Current: 1.5A; Power Supply Rejection Ratio (PSRR): 75dB@(120Hz); Feature: 短路保护；热保护(TSD)；过流保护(OCP); Output Polarity: 正极
U66 = TPS5450QDDARQ1: 功能类型:降压型;输出类型:可调;工作电压:5.5V~36V;输出电压:1.221V~32.04V;输出电流:5A;; LCSC Part Name: 5A宽输入范围降压转换器; Supplier Part: C181270; Manufacturer: TI(德州仪器); Supplier Footprint: SOIC-8-EP; JLCPCB Part Class: 扩展库; Datasheet: https://www.ti.com/cn/lit/gpn/tps5450-q1; Supplier: LCSC; Function: 降压型; Output Type: 可调; Input Voltage: 5.5V~36V; Output Voltage: 1.221V~32.04V; Output Current: 5A; Switching Frequency: 500kHz; Operating Temperature: -40℃~+125℃@(TJ); Synchronous Rectification: 否; Number of Outputs: 1; Topology: 降压式; Switch tube (built-in/external): 内置
U68 = AMS1117-3.3_C6186: LCSC Part Name: 输出3.3V 1A; Supplier Part: C6186; Manufacturer: AMS; Supplier Footprint: SOT-223; JLCPCB Part Class: 基础库; Datasheet: https://atta.szlcsc.com/upload/public/pdf/source/20180727/C6186_7A095716F0823C02F1997A905E26C086.pdf; Supplier: LCSC; Output Type: 固定; Output Voltage: 3.3V; Output Current: 1A; Power Supply Rejection Ratio (PSRR): 72dB@(120Hz); Voltage Dropout: 1.3V@(800mA); Features: 过流保护(OCP)；热关断(TSD); Output Configuration: 正极; Number of Outputs: 1
U69 = B0505S-2WR3_1: LCSC Part Name: DC-DC输入5V输出5V 400mA 2W输出短路保护; Supplier Part: C7465195; Manufacturer: EVISUN(易成); Supplier Footprint: SIP-7; JLCPCB Part Class: 扩展库; Datasheet: https://atta.szlcsc.com/upload/public/pdf/source/20230718/8395FAD21C4653B2A4E437FD2561EC61.pdf; Supplier: LCSC; Power: 2W; input voltage (Vdc): 4.5V~5.5V; Conversion Efficiency: 88%; Output Voltage: 5V; Output Current (Max): 400mA; Maximum Capacitive Load: 2400uF; Insulated Voltage: 1.5kV; Protective function: 短路保护
U71 = B1212S-1WR3: Supplier Part: C3031174; Manufacturer: YLPTEC(易川); Supplier Footprint: 插件; JLCPCB Part Class: 扩展库; Datasheet: https://atta.szlcsc.com/upload/public/pdf/source/20220507/D4A14754AF1A932D99A68D6BE212C636.pdf; Supplier: LCSC; Number of channel: 1; Power: 1W; input voltage (Vdc): 10.8V~13.2V; Conversion Efficiency: 90%; Output Voltage: 12V; Output Current (Max): 84mA; Maximum Capacitive Load: 560uF; Insulated Voltage: 1500V; Protective function: 短路保护；低功耗
U72 = B1224S-2WR2_C5369493: Supplier Part: C5369493; Manufacturer: YLPTEC(易川); Supplier Footprint: SIP-4; JLCPCB Part Class: 扩展库; Datasheet: https://atta.szlcsc.com/upload/public/pdf/source/20230417/6175517A6BEA4EA30032C9B0849BCE1C.pdf; Supplier: LCSC; TYPE: 升压型; Number of channel: 1; Power: 1W; input voltage (Vdc): 10.8V~13.2V; Conversion Efficiency: 86%; Output Voltage: 24V; Output Current (Max): 83mA; Maximum Capacitive Load: 220uF; Insulated Voltage: 1500V; Protective function: 短路保护
CN17 = WAFER-XH254Z-8A: Supplier Part: C7432688; Manufacturer: HANBO(汉博); Supplier Footprint: 插件,P=2.5mm; Datasheet: https://atta.szlcsc.com/upload/public/pdf/source/20230718/3B4FABA5D38EFB02DAF74E7C2B33D98F.pdf; Supplier: LCSC; Pins Structure: 1x8P; Pitch: 2.54mm; Mounting Type: 直插; Reference Series: XH; Number of Pins: 8P; Number of Rows: 1; Number of PINs Per Row: 8; Current Rating: 3A; Operating Temperature: -25℃~+85℃
D11-D13 = SMCJ6.5CA: Supplier Part: C357972; Manufacturer: DOWO(东沃); Supplier Footprint: SMC(DO-214AB); Datasheet: https://atta.szlcsc.com/upload/public/pdf/source/20191017/C439028_D625D4A0C69D29C23F87D767460E4719.pdf; Supplier: LCSC; Reverse Stand-Off Voltage (Vrwm): 6.5V; Maximum Clamping Voltage: 11.2V; Peak Pulse Current (Ipp)@10/1000us: 133.93A; Breakdown Voltage: 7.22V; Type: TVS
H5 = HDR-F_2.54_1x2P: Supplier Part: C49661; Supplier Footprint: 插件
Q8 = S8050 J3Y(RANGE:200-350): LCSC Part Name: H档(200-350); Supplier Part: C2146; Manufacturer: CJ(江苏长电/长晶); Supplier Footprint: SOT-23; JLCPCB Part Class: 基础库; Datasheet: https://atta.szlcsc.com/upload/public/pdf/source/20231013/FF37B6A000E6CDA75C9C999D2E78731F.pdf; Supplier: LCSC; type: NPN; Current - Collector(Ic): 500mA; Collector - Emitter Voltage VCEO: 25V; Pd - Power Dissipation: 300mW; DC Current Gain: 200@500mA,1V; Transition frequency(fT): 150MHz; Current - Collector Cutoff: 100nA; Vce Saturation(VCE(sat)): 600mV; Operating Temperature: -55℃~+150℃
U3 = FM24C256E-TS-T-G: Supplier Part: C908401; Manufacturer: FM(复旦微); Supplier Footprint: TSSOP-8; JLCPCB Part Class: 扩展库; Datasheet: https://atta.szlcsc.com/upload/public/pdf/source/20201022/C908401_093478EC813A3C8E669EA33A8F04B20F.pdf; Supplier: LCSC
U31 = MAX485ESA_C42436900: Supplier Part: C42436900; Manufacturer: IDCHIP(英锐芯); Supplier Footprint: SOP-8; Datasheet: https://atta.szlcsc.com/upload/public/pdf/source/20250107/85D826F9079532A60184A70C29AA2166.pdf; Supplier: LCSC
U53 = ADUM3201ARZ: LCSC Part Name: 双通道数字隔离器; Supplier Part: C660765; Manufacturer: ADI(亚德诺); Supplier Footprint: SOIC-8; Datasheet: https://atta.szlcsc.com/upload/public/pdf/source/20180524/C208140_3A204B629C98CB85777430D6F21BA479.pdf; Supplier: LCSC; Number of Forward Channels: 1; Number of Reverse Channels: 1; Data Rate(Max): 1Mbps; Isolation Voltage(Vrms): 2500; CMTI(kV/us): 35kV/us; Integrated Power Supply: 否; Operating Temperature: -40℃~+105℃; Rating: 车规级
U55 = MAX232ESE+T: LCSC Part Name: MAX232ESE+T 5V供电，多通道RS-232驱动器/接收器; Supplier Part: C26860; Manufacturer: ADI(亚德诺)/MAXIM(美信); Supplier Footprint: SOIC-16; JLCPCB Part Class: 扩展库; Datasheet: https://atta.szlcsc.com/upload/public/pdf/source/20140314/1457707016539.pdf; Supplier: LCSC; Types: 收发器; Number of Driver: 2; Number of receiver: 2; Data Rate: 120Kbps; Supply Voltage: 4.5V~5.5V; Operating Temperature: -40℃~+85℃
C67 = 25V100uF CD288: LCSC Part Name: 100uF ±20% 25V; Supplier Part: C2960378; Manufacturer: HRK(鸿瑞凯电子); Supplier Footprint: 插件,D6.3xL12mm; JLCPCB Part Class: 扩展库; Datasheet: https://atta.szlcsc.com/upload/public/pdf/source/20220224/9938EF654EEBF86801C1969536388E0B.pdf; Supplier: LCSC; Tolerance: ±20%; Rated Voltage: 25V; Lead Spacing: 2.5mm; φD: 6.3mm; L: 12mm; Operating Temperature: -40℃~+105℃
C97 = TAJA106K010RNJ: 容值:10uF;精度:±10%;额定电压:10V;等效串联电阻:3Ω@100kHz;; LCSC Part Name: 10uF ±10% 10V; Supplier Part: C7177; Manufacturer: Kyocera AVX; Supplier Footprint: CASE-A-3216; JLCPCB Part Class: 扩展库; Datasheet: https://atta.szlcsc.com/upload/public/pdf/source/20160107/1457707750344.pdf; Supplier: LCSC; Tolerance: ±10%; Rated Voltage: 10V; Equivalent Series Resistance(ESR): 3Ω@100kHz; Operating Temperature: -55℃~+125℃
CN1-CN4 CN9 CN14 = WAFER-XH254Z-4A: Supplier Part: C7432684; Manufacturer: HANBO(汉博); Supplier Footprint: 插件,P=2.5mm; JLCPCB Part Class: 扩展库; Datasheet: https://atta.szlcsc.com/upload/public/pdf/source/20230718/3B4FABA5D38EFB02DAF74E7C2B33D98F.pdf; Supplier: LCSC; Pins Structure: 1x4P; Pitch: 2.54mm; Mounting Style: 直插; Reference Series: XH; Number of Pins: 4P; Number of Rows: 1; Number of PINs Per Row: 4; Current Rating (Max): 3A; Operating Temperature Range: -25℃~+85℃
D6 D14 D15 = SS14_C2480: LCSC Part Name: 电压:40V 电流:1A; Supplier Part: C2480; Manufacturer: MDD(辰达半导体); Supplier Footprint: SMA(DO-214AC); JLCPCB Part Class: 基础库; Datasheet: https://atta.szlcsc.com/upload/public/pdf/source/20240710/EF24798823EE33D63F154ED67BAC5E71.pdf; Supplier: LCSC; Diode Configuration: 独立式; Forward Voltage (Vf@If): 550mV@1A; Reverse Voltage (Vr): 40V; Rectified Current: 1A; Reverse Leakage Current (Ir): 300uA@40V
L1 = SL0420-3R3M: LCSC Part Name: 3.3uH ±20% 4A; Supplier Part: C22463807; Manufacturer: 台湾陆海; Supplier Footprint: SMD,4.5x4.1mm; JLCPCB Part Class: 扩展库; Datasheet: https://atta.szlcsc.com/upload/public/pdf/source/20240611/8DE7D6BE1273F2E871C82A6D5C20B08D.pdf; Supplier: LCSC; Tolerance: ±20%; Rated Current: 3.5A; Saturation Current (Isat): 4A
L8 = VLCF5028T-101MR33-2: LCSC Part Name: 100uH ±20% 330mA; Supplier Part: C360731; Manufacturer: TDK; Supplier Footprint: SMD; JLCPCB Part Class: 扩展库; Datasheet: https://atta.szlcsc.com/upload/public/pdf/source/20190108/C360731_CF705F0BFE8C35AFB579C078BC28CF4C.pdf; Supplier: LCSC; Tolerance: ±20%; Rated Current: 330mA; Saturation Current (Isat): 330mA; DC Resistance (DCR): 580mΩ
PR1 = R_3386P: Supplier Footprint: 直插
Q13 = BSP149: LCSC Part Name: 耐压:200V 电流:1A; Supplier Part: C7603335; Manufacturer: TECH PUBLIC(台舟); Supplier Footprint: SOT-223; Datasheet: https://atta.szlcsc.com/upload/public/pdf/source/20230906/44CACB5CC2252CDF43648C13BB554326.pdf; Supplier: LCSC; Drain to Source Voltage: 200V; Current - Continuous Drain(Id): 1A; RDS(on): 1.35Ω@10V,0.425A; Pd - Power Dissipation: 2.1W; Gate Threshold Voltage (Vgs(th)@Id): 2V; Gate Charge(Qg): 3.2nC@5V; Input Capacitance(Ciss@Vds): 148pF; Reverse Transfer Capacitance (Crss@Vds): 11.3pF; Operating Temperature: -55℃~+150℃
RLY1 = SRD-05VDC-SL-C: 线圈电压:5V;触点形式:一组转换:1C(单刀双掷-转换);触点容量(电阻负载):-;最大切换电压:250V@AC;最大切换电流:15A;; LCSC Part Name: 蓝色; Supplier Part: C35449; Manufacturer: 松乐; Supplier Footprint: 插件,15.6x19.2mm; JLCPCB Part Class: 扩展库; Datasheet: https://atta.szlcsc.com/upload/public/pdf/source/20200305/C490149_C96E4098A3B1FFB377D5AD2E40B7C2A8.pdf; Supplier: LCSC; Coil Voltage: 5V; Contact Form: 一组转换:1C(单刀双掷-转换); Pin Number: 5; Maximum Switching Voltage: 250V@AC; Coil Rated Power: 360mW; Maximum Switching Current: 15A; Coil Type: 无极性-单线圈; Coil Resistance: 70Ω; Contact Resistance: 100mΩ; Operate Time: 10ms; Release Time: 10ms
U9 = SX1301: LCSC Part Name: 1MHz 2A 升压型电流模式PWM转换器; Supplier Part: C80206; Manufacturer: SX(硕芯科技); Supplier Footprint: SOT-23-6; JLCPCB Part Class: 扩展库; Datasheet: https://atta.szlcsc.com/upload/public/pdf/source/20160920/1474356679800.pdf; Supplier: LCSC; Function: 升压型; Output Type: 可调; Voltage - Supply: 2.6V~5.5V; Output Voltage: 12V; Output Current: 2A; Frequency - Switching: 1MHz; Operating Temperature: -40℃~+85℃; Synchronous Rectifier: 否; Number of Outputs: 1; Topology: 升压式; Quiescent Current: 190uA; Switch tube (built-in/external): 内置
U44 = LMV321: Supplier Part: C2904381; Manufacturer: Slkor(萨科微); Supplier Footprint: SOT-23-5; JLCPCB Part Class: 扩展库; Datasheet: https://atta.szlcsc.com/upload/public/pdf/source/20211008/F7FE51BBE778A8191EAE612DAA5D60E0.pdf; Supplier: LCSC; Number of Channels: 单路; Maximum Power Supply Range (Vdd-Vss): 5.5V; Gain Bandwidth Product: 1MHz; Vos - Input Offset Voltage: 9mV; Slew Rate: 400V/ms; Noise density(eN): 40nV/√Hz@1kHz; Common Mode Rejection Ratio(CMRR): 85dB; Operating Temperature: -40℃~+85℃
U50 = LM385-1.2: Supplier Part: C5274784; Manufacturer: Sungine(双竞集成); Supplier Footprint: SOT-23; JLCPCB Part Class: 扩展库; Datasheet: https://atta.szlcsc.com/upload/public/pdf/source/20221123/824A7464513156A898F90E9123024B31.pdf; Supplier: LCSC; Reference Type: 并联
U51 = TLC2652I-8DR: 放大器数:单路;增益带宽积(GBP):1.9MHz;输入偏置电流(Ib):4pA;输入失调电压(Vos):600nV;压摆率(SR):3.1V/us;带宽(-3db):-;轨到轨:-;; LCSC Part Name: TLC2652I 8DR; Supplier Part: C2060229; Manufacturer: TI(德州仪器); Supplier Footprint: SOIC-8; JLCPCB Part Class: 扩展库; Datasheet: https://www.ti.com/cn/lit/gpn/tlc2652; Supplier: LCSC; Number of Circuits: 单路; Gain Bandwidth Product(GBP): 1.9MHz; Current - Input Bias(Ib): 4pA; Voltage - Input Offset(Vos): 600nV; Slew Rate(SR): 3.1V/us; Operating Temperature: -40℃~+85℃
U52 = WAFER-XH254Z-3A: 插针结构:1x3P;间距:2.54mm;安装方式:直插;参考系列:XH;总PIN数:3P;排数:1;每排PIN数:3;额定电流:3A;工作温度范围:-25℃~+85℃;; Supplier Part: C7432683; Manufacturer: HANBO(汉博); Supplier Footprint: 插件,P=2.5mm; JLCPCB Part Class: 扩展库; Datasheet: https://atta.szlcsc.com/upload/public/pdf/source/20230718/3B4FABA5D38EFB02DAF74E7C2B33D98F.pdf; Supplier: LCSC; Pins Structure: 1x3P; Pitch: 2.54mm; Mounting Style: 直插; Reference Series: XH; Number of Pins: 3P; Number of Rows: 1; Number of PINs Per Row: 3; Current Rating (Max): 3A; Operating Temperature Range: -25℃~+85℃
U58 = LM258: Supplier Part: C2941724; Manufacturer: IDCHIP(英锐芯); Supplier Footprint: SOIC-8; JLCPCB Part Class: 扩展库; Datasheet: https://atta.szlcsc.com/upload/public/pdf/source/20220516/E4542368D0957ADDA218DD952EA2EC9F.pdf; Supplier: LCSC; Number of Circuits: 双路; Voltage - Input Offset(Vos): 5mV; Common Mode Rejection Ratio (CMRR): 70dB; Operating Temperature: -25℃~+85℃
U59-U62 = GS8552-SR: Supplier Part: C157716; Manufacturer: Gainsil(聚洵); Supplier Footprint: SOIC-8; JLCPCB Part Class: 扩展库; Datasheet: https://atta.szlcsc.com/upload/public/pdf/source/20200615/C605420_EE0E567F8FF01D919583B114644E1CC3.pdf; Supplier: LCSC; Number of Circuits: 双路; Gain Bandwidth Product(GBP): 1.8MHz; Slew Rate(SR): 0.95V/us; Supply Voltage: 1.8V~5.5V; Supply Current: 180uA; Operating Temperature: -40℃~+125℃
U63 U64 = ECHU1H104GX9: LCSC Part Name: 100nF ±2% 50V; Supplier Part: C569828; Manufacturer: PANASONIC(松下); Supplier Footprint: SMD,3.3x4.8mm; JLCPCB Part Class: 扩展库; Datasheet: https://atta.szlcsc.com/upload/public/pdf/source/20220809/B356321415F8631839B7E00F26E4D429.pdf; Supplier: LCSC; Tolerance: ±2%; Voltage Rated: 50V

## Nets
3.3V: C1.1 C2.1 C3.1 C4.1 C5.1 C6.1 C135.2 C136.2 H1.1 LED3.2(A) R2.1 R105.2 R112.1 U2.11(VDD_5) U2.22(VDDA) U2.28(VDD_4) U2.50(VDD_1) U2.75(VDD_2) U2.100(VDD_3) U68.2(VOUT) U68.4(VOUT)
5V: C10.1 C11.1 C45.2 C63.1 C91.2 C100.1 C114.2 C117.2 C119.2 C120.1 C122.2 C123.2 C124.2 C125.2 C133.2 C134.2 CN8.3 CN10.3 CN11.3 CN12.3 CN16.3 D14.2(A) D16.2(A) H4.3 Q9.2(E) Q10.2(E) Q12.2(E) R23.2 R24.2 R25.2 R26.2 R27.2 R28.2 R29.2 R30.2 R31.2 R32.2 R33.2 R35.2 R37.2 R96.1 RN1.1 RN1.2 RN1.3 RN1.4 RN2.1 RN2.2 RN2.3 RN2.4 RN3.1 RN3.2 RN3.3 RN3.4 RN4.1 RN4.2 RN4.3 RN4.4 RN5.1 RN5.2 RN5.3 RN5.4 RN6.1 RN6.2 RN6.3 RN6.4 RN7.1 RN7.2 RN7.3 RN7.4 U3.8(VCC) U8.8(V+) U32.3(VDD) U44.5(VCC+) U45.2(A) U51.7(VDD+) U53.1(VDD1) U55.16(VCC) U58.8(V+) U59.8(+V) U60.8(+V) U61.8(+V) U62.8(+V) U68.3(VIN) U69.6(+Vo)
6.6V: C26.2 C102.1 CN1.1 CN2.1 CN3.1 CN4.1 CN9.2 D15.1(K) R5.2 R44.2
9.9V: C30.1 C31.2 CN9.1 D2.1(C) R124.2 U13.1(K) U38.2(VOUT) U39.2(A)
12V: C27.2 CN18.3 U38.3(VIN) U39.1(K) U71.4(+VO)
24V: CN15.3 U72.6(+Vo)
-5V: C21.1 C90.2 C113.2 Q13.1(G) U8.5(VOUT) U51.4(VDD-) U63.1 U64.1
AGND: C101.2 H3.3 H3.4 U53.5(GND2)
GND: BAT1.1 C1.2 C2.2 C3.2 C4.2 C5.2 C6.2 C7.2 C8.2 C9.2 C10.2 C11.2 C21.2 C26.1 C27.1 C29.2 C30.2 C31.1 C45.1 C47.2 C49.2 C52.2 C54.2 C63.2 C64.1 C66.2 C67.2 C68.1 C69.1 C70.1 C71.1 C72.1 C73.1 C74.1 C75.1 C76.1 C77.2 C79.2 C82.2 C85.2 C87.2 C89.2 C90.1 C91.1 C98.2 C99.2 C100.2 C102.2 C103.2 C104.1 C106.1 C112.2 C113.1 C114.1 C118.1 C119.1 C120.2 C121.1 C122.1 C123.1 C124.1 C125.1 C126.2 C127.2 C128.1 C130.2 C131.2 C132.1 C133.1 C134.1 C135.1 C136.1 CN1.2 CN2.2 CN3.2 CN4.2 CN8.1 CN9.4 CN10.1 CN11.1 CN12.1 CN14.1 CN14.3 CN15.1 CN17.7 CN17.8 CN18.1 CN19.1 D2.2(A) D7.2(A) D8.2(A) D9.2(A) D10.2(A) D11.1(A2) D13.2(A1) H1.4 H4.1 PR1.1 PR1.2 Q1.3(C) Q13.3(S) R4.2 R6.1 R43.2 R45.2 R48.2 R53.1 R56.1 R59.1 R62.1 R73.1 R91.1 R92.1 R93.1 R98.2 R101.1 R107.1 R108.2 R117.2 R119.1 R122.1 R123.1 R125.1 RLY1.1 SW1.1 U2.10(VSS_5) U2.19(VSSA) U2.20(VREF-) U2.27(VSS_4) U2.49(VSS_1) U2.74(VSS_2) U2.99(VSS_3) U3.1(A0) U3.2(A1) U3.3(A2) U3.4(VSS) U3.7(WP) U8.3(GND) U8.4(CAP-) U9.2(GND) U31.4(DI) U31.5(GND) U32.1(GND) U34.3(E) U36.3(E) U44.2(GND) U50.2(A) U51.3(IN+) U52.3 U53.4(GND1) U54.3(A) U55.15(GND) U58.4(V-) U59.4(-V) U60.4(-V) U61.4(-V) U62.4(-V) U66.6(GND) U66.9(EPAD) U67.2(A) U68.1(GND) U69.2(-VI) U69.4(-Vo) U71.1(GND) U71.3(-VO) U72.2(GND) U72.4(-Vo)
VIN: CN6.1 CN7.1 R44.1 R118.1 U35.1(K) U37.1(K)
A+: D12.2(A1) D13.1(A2) H3.20 R42.2 U31.6(A)
AD1: C80.1 R79.2 RN8.5 U59.1(OUT)
AD2: C78.1 R76.2 RN8.6 U59.7(OUT)
AD3: C83.1 R86.2 RN8.7 U60.1(OUT)
AD4: C86.1 R90.2 RN8.8 U60.7(OUT)
AD5: C50.1 R55.2 RN9.5 U61.1(OUT)
AD6: C48.1 R52.2 RN9.6 U61.7(OUT)
AD7: C55.1 R61.2 RN9.7 U62.1(OUT)
AD8: C53.1 R58.2 RN9.8 U62.7(OUT)
AD9: R120.1 RN10.5 U58.1(OUT A)
AD10: R115.1 RN10.8 U58.7(OUT B)
ADC1: C68.2 RN8.4 U2.15(PC0)
ADC2: C69.2 RN8.3 U2.16(PC1)
ADC3: C70.2 RN8.2 U2.17(PC2)
ADC4: C71.2 RN8.1 U2.18(PC3)
ADC5: C72.2 RN9.4 U2.23(PA0-WKUP)
ADC6: C73.2 RN9.3 U2.24(PA1)
ADC7: C74.2 RN9.2 U2.29(PA4)
ADC8: C75.2 RN9.1 U2.30(PA5)
ADC9: C76.2 RN10.4 U2.31(PA6)
ADC10: C121.2 RN10.1 U2.32(PA7)
B-: D11.2(A1) D12.1(A2) H3.19 R43.1 U31.7(B)
DA_CLK: RN7.7 U2.52(PB13) U29.3(CATHODE)
DA_CLK_O: H3.16 R36.2 U29.5(COLLECTOR)
DA_MOSI: RN7.6 U2.54(PB15) U28.3(CATHODE)
DA_MOSI_O: H3.17 R34.2 U28.5(COLLECTOR)
DA_SYNC: RN7.8 U2.51(PB12) U30.3(CATHODE)
DA_SYNC_O: H3.15 R38.2 U30.5(COLLECTOR)
DC5V: C130.1 C131.1 C132.2 CN17.1 CN17.2 L9.2 LED2.2(A) R121.1 U69.1(+VI)
DC12V: CN19.2 U1.2(A) U71.2(VIN) U72.1(+Vin)
DS18B20_1: RN6.5 U2.56(PD9) U32.2(DQ)
DS18B20_2: H4.2 RN7.5 U2.55(PD8)
H+: CN14.4 L8.1
HEAT: R47.1 RN4.7 U2.66(PC9) U18.2
HEAT_O: H3.5 U18.4
OGND: C41.2 C42.2 C43.2 C44.2 H3.2 Q8.2(E) U18.3 U19.3 U20.3 U21.3 U22.3 U23.3 U24.3 U25.3 U26.3 U27.3 U28.4(EMITTER) U29.4(EMITTER) U30.4(EMITTER)
OSC_IN: C7.1 R1.2 U2.12(OSC_IN) X3.2(OSC2)
OSC_IN1: C98.1 U2.8(PC14-OSC32_IN) X2.2
OSC_OUT: C8.1 R1.1 U2.13(OSC_OUT) X3.1(OSC1)
OSC_OUT1: C99.1 U2.9(PC15-OSC32_OUT) X2.1
OVDD: C41.1 C42.1 C43.1 C44.1 C101.1 H3.1 R34.1 R36.1 R38.1 R39.1 R42.1 U28.6(VCC) U29.6(VCC) U30.6(VCC) U31.8(VCC) U53.8(VDD2)
P_KEY: RN3.6 U2.95(PB8)
P_LOCK: RN3.5 U2.96(PB9)
PUMP: R50.1 RN4.6 U2.65(PC8)
PUMP_O: H3.6 U19.4
RANG: R104.2 RN4.8 U2.67(PA8)
RL0: U2.63(PC6) U19.2
RL1: RN4.5 U2.64(PC7) U20.2
RL1_O: H3.7 U20.4
RL2: RN5.8 U21.2
RL2_O: H3.8 U21.4
RL3: RN5.7 U2.62(PD15) U22.2
RL3_O: H3.9 U22.4
RL4: RN5.6 U2.61(PD14) U23.2
RL4_O: H3.10 U23.4
RL5: RN5.5 U2.60(PD13) U24.2
RL5_O: H3.11 U24.4
RL6: RN6.8 U2.59(PD12) U25.2
RL6_O: H3.12 U25.4
RL7: RN6.7 U2.58(PD11) U26.2
RL7_O: H3.13 U26.4
RL8: RN6.6 U2.57(PD10) U27.2
RL8_O: H3.14 U27.4
RX: H5.1 U55.8(R2IN)
RX2: R109.1 U53.7(VIA)
RXD1: CN1.4 CN2.4 CN3.4 CN4.4 R3.1 RN1.7 U2.69(PA10)
RXD2: RN2.7 U2.26(PA3) U53.2(VOA) U55.9(R2OUT)
RXD3: RN2.5 U2.48(PB11)
RXD4: CN17.4 RN1.5 U2.79(PC11)
S+: C65.1 CN14.2 R72.2 U44.4(OUT)
SCL: RN3.8 U2.92(PB6) U3.6(SCL)
SDA: RN3.7 U2.93(PB7) U3.5(SDA)
SWCLK: H1.2 U2.76(PA14)
SWDIO: H1.3 U2.72(PA13)
TX: H5.2 U55.7(T2OUT)
TX2: R40.1 U53.6(VOB)
TXD1: CN1.3 CN2.3 CN3.3 CN4.3 R3.2 RN1.8 U2.68(PA9)
TXD2: RN2.8 U2.25(PA2) U53.3(VIB) U55.10(T2IN)
TXD3: RN2.6 U2.47(PB10)
TXD4: CN17.5 CN17.6 RN1.6 U2.78(PC10)
VREF: C89.1 R71.1 R94.1 R96.2 R100.2 U50.1(K) U50.3(R)
$1N10769: R23.1 U18.1
$1N10849: R24.1 U19.1
$1N10917: R25.1 U20.1
$1N10985: R26.1 U21.1
$1N11233: R27.1 U22.1
$1N11238: R29.1 U24.1
$1N11249: R28.1 U23.1
$1N11257: R30.1 U25.1
$1N11385: R31.1 U26.1
$1N11399: R32.1 U27.1
$1N11746: R33.1 U28.1(ANODE)
$1N11995: R35.1 U29.1(ANODE)
$1N12152: R37.1 U30.1(ANODE)
$1N13224: CN6.3 U34.2(C) U35.2(A)
$1N13327: R45.1 R46.2 U34.1(B)
$1N13442: Q9.1(B) R47.2
$1N13444: Q9.3(C) R46.1
$1N13706: Q10.1(B) R50.2
$1N13710: R48.1 R49.2 U36.1(B)
$1N13712: Q10.3(C) R49.1
$1N13717: CN7.3 U36.2(C) U37.2(A)
$1N35816: LED1.2(A) R105.1
$1N35863: LED1.1(K) U2.80(PC12)
$1N36059: R107.2 U2.37(PB2)
$1N36185: R108.1 U2.94(BOOT0)
$1N69466: C104.2 R112.2 U2.21(VREF+) U54.1(C) U54.2(R)
$1N69682: C106.2 D16.1(K) D17.1(K) U2.6(VBAT)
$1N69856: BAT1.2 D17.2(A)
$1N132796: C9.1 R2.2 SW1.2 U2.14(NRST)
$2N4664: C112.1 U8.2(CAP+)
$2N8052: C126.1 C127.1 C128.2 U1.1(C) U66.7(VIN)
$2N8055: C129.2 L9.1 U66.8(PH) U67.1(C)
$2N8056: C129.1 U66.1(BOOT)
$2N8060: R4.1 R121.2 U66.4(VSENSE)
$2N8062: LED2.1(C) R122.2
$2N8328: LED3.1(C) R123.2
$2N8964: R124.1 R125.2 U38.1(ADJ)
$2N8969: C29.1 Q1.1(B) R126.1 U13.2(A)
$2N8970: Q1.2(E) R126.2
$3N1042: Q8.3(C) R39.2 U31.2(RE#) U31.3(DE)
$3N1047: R109.2 U31.1(RO)
$3N1052: Q8.1(B) R40.2
$3N1563: C115.2 U55.1(C1+)
$3N1568: C115.1 U55.3(C1-)
$3N1575: C116.2 U55.4(C2+)
$3N1579: C116.1 U55.5(C2-)
$3N1682: C117.1 U55.2(V+)
$3N1687: C118.2 U55.6(V-)
$4N4268: C64.2 PR1.3 R71.2 U44.1(IN+)
$4N4274: C65.2 R72.1 R73.2 U44.3(IN-)
$4N4275: D6.2(A) U45.1(K)
$4N4280: CN10.2 R57.1
$4N4282: C55.2 R61.1 R62.2 U62.2(INVERTING INPUT)
$4N4285: C54.1 R60.2 U62.3(NONINVERTING INPUT)
$4N4286: CN11.2 R60.1
$4N4292: C87.1 CN15.2 R89.1 R92.2
$4N4300: C86.2 R90.1 R91.2 U60.6(INVERTING INPUT)
$4N4302: CN12.2 R85.1 R87.1 R88.1
$4N4303: C82.1 R87.2 U60.3(NONINVERTING INPUT)
$4N4304: C85.1 R89.2 U60.5(NONINVERTING INPUT)
$4N4305: C83.2 D9.1(K) R86.1 R88.2 U60.2(INVERTING INPUT)
$4N4306: C88.2 CN16.1 R93.2 R94.2 R95.2
$4N4312: C88.1 CN16.2 R75.1 R81.1 R84.1 R85.2 R95.1
$4N4323: U51.1(CXA) U64.2
$4N4335: C50.2 R55.1 R56.2 U61.2(INVERTING INPUT)
$4N4336: CN8.2 R51.1
$4N4337: C47.1 R51.2 U61.5(NONINVERTING INPUT)
$4N4338: C48.2 R52.1 R53.2 U61.6(INVERTING INPUT)
$4N4343: C49.1 R54.2 U61.3(NONINVERTING INPUT)
$4N4354: C78.2 D7.1(K) R76.1 R81.2 U59.6(INVERTING INPUT)
$4N4356: Q12.1(B) R104.1
$4N4360: C77.1 R75.2 U59.5(NONINVERTING INPUT)
$4N4362: C80.2 D8.1(K) R79.1 R83.2 U59.2(INVERTING INPUT)
$4N4364: C79.1 R82.2 U59.3(NONINVERTING INPUT)
$4N4374: C52.1 R57.2 U62.5(NONINVERTING INPUT)
$4N4375: C53.2 R58.1 R59.2 U62.6(INVERTING INPUT)
$4N4381: R98.1 R100.1 U52.1
$4N4382: R97.1 U52.2
$4N4390: CN9.3 R54.1
$4N4397: C66.1 C67.1 D6.1(K) L8.2
$4N5122: C103.1 D14.1(K) L1.2 U9.4(EN) U9.5(VCC)
$4N5124: R5.1 R6.2 U9.3(FB)
$4N5126: D15.2(A) L1.1 U9.1(LX)
$4N6096: R120.2 U58.2(IN A-)
$4N6188: R118.2 R119.2 U58.3(IN A+)
$4N6233: R116.1 R117.1 U58.5(IN B+)
$4N6237: CN18.2 R116.2
$4N6253: R115.2 U58.6(IN B-)
$4N9059: D10.1(K) Q12.3(C) RLY1.4
$4N11855: C94.2 C95.2 C96.2 C97.1 Q13.2(D) Q13.4(D) R97.2 R99.1 R101.2 RLY1.2 U51.2(IN-)
$4N11960: C94.1 C95.1 C96.1 C97.2 R82.1 R83.1 R84.2 R99.2 R102.1 U51.6(OUT)
$4N12322: R102.2 RLY1.5
$4N13531: U51.8(CXB) U63.2

Not connected (* = marked no-connect by the designer): CN6 2*; CN7 2*; CN17 3*; H3 18*; RLY1 3*; RN10 2* 3* 6* 7*; SCREW1 1*; SCREW2 1*; SCREW3 1*; SCREW4 1*; U2 1(PE2)* 2(PE3)* 3(PE4)* 4(PE5)* 5(PE6)* 7(PC13-TAMPER-RTC)* 33(PC4)* 34(PC5)* 35(PB0)* 36(PB1)* 38(PE7)* 39(PE8)* 40(PE9)* 41(PE10)* 42(PE11)* 43(PE12)* 44(PE13)* 45(PE14)* 46(PE15)* 53(PB14)* 70(PA11)* 71(PA12)* 73(NC)* 77(PA15)* 81(PD0)* 82(PD1)* 83(PD2)* 84(PD3)* 85(PD4)* 86(PD5)* 87(PD6)* 88(PD7)* 89(PB3)* 90(PB4)* 91(PB5)* 97(PE0)* 98(PE1)*; U8 1(NC)* 6(VOLTAGE(LV)LOW)* 7(OSC)*; U9 6(OC)*; U51 5(CLAMP)*; U55 11(T1IN)* 12(R1OUT)* 13(R1IN)* 14(T1OUT)*; U66 2(NC)* 3(NC)* 5(ENA)*

## Notes on the sheets
sheet 1
- 网络与单片机网络一致
- √
- √
- √
- √
- √
- √
- √
- √
- √
- √
- √
- √
- √
- 程序下载端口
- √
- √
- √
- 气泵
- 氢气加热
- 电源
- 氢传感器温度
- 温度
sheet 2
- 5V转-5V
- 红外供电
- LDO电路
sheet 3
- 屏幕线
- MAX232
- MAX485
sheet 4
- 离子流氧
- 微量氧
- AD=1
- 105=1uF
- 104=0.1uF=100nF
- AD=10
- 常量氧/顺磁氧
- AD=100
- VREF=1.6V
- 露点
- 氢气
- 不用
- 5V升压至6.6V
- 升压问题
- 红外
